# Altium project RockRTK.PrjPcb (part 1 of 2)
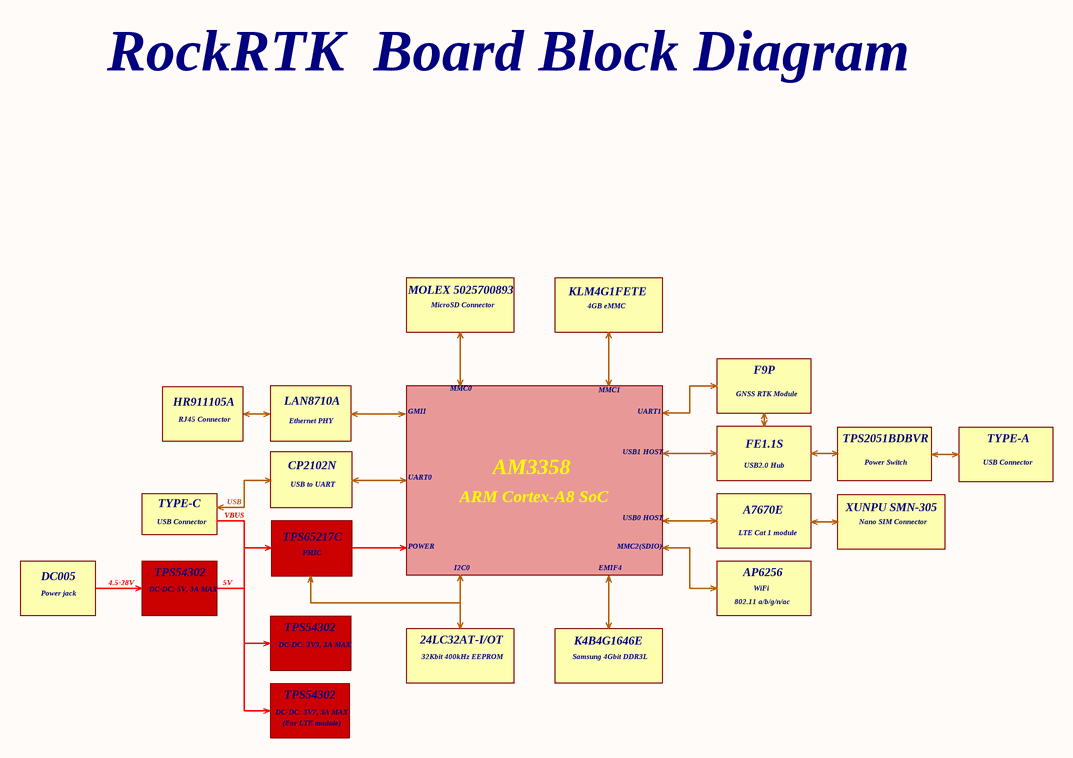
[diagram p0: BlockDiagram.SchDoc]
22 sheets, 400 parts. Net scope: hierarchical (ports join the sheet entries above them; power ports are global).
Board file: RockRTK.PcbDoc
Sheets:
  BlockDiagram.SchDoc
  Main.SchDoc
    DDR3L Chip = DDR3LChip.SchDoc
    AM3358 DDR Controller = SoC_DDR.SchDoc
    Designator = InputConnectors.SchDoc
    Designator = PMIC.SchDoc
    Designator = PowerSupplies.SchDoc
    Designator = SoC_BootMode.SchDoc
    Designator = SoC_Power.SchDoc
    Designator = SoC_Control.SchDoc
    Designator = eMMCChip.SchDoc
    SoC MMC = SoC_MMC.SchDoc
    Designator = SoC_Peripheral.SchDoc
    Designator = USBHub.SchDoc
    Designator = GNSSModule.SchDoc
    Designator = LTEModule.SchDoc
    Designator = WIFIModule.SchDoc
    Designator = EEPROM.SchDoc
    Designator = EthernetPHY.SchDoc
    Designator = SoC_MII.SchDoc
    Designator = SoC_Jtag.SchDoc
    Micro SD Card = SDCard.SchDoc

## Sheet BlockDiagram.SchDoc
size A4; SheetNumber: 1; SheetTotal: 22

### Notes on the sheet
- RockRTK  Board Block Diagram
- MOLEX 5025700893
- MicroSD Connector
- KLM4G1FETE
- 4GB eMMC
- MMC0
- MMC1
- GNSS RTK Module
- F9P
- HR911105A
- RJ45 Connector
- LAN8710A
- CP2102N
- Ethernet PHY
- GMII
- AM3358
- USB1 HOST
- UART1
- USB2.0 Hub
- FE1.1S
- TPS2051BDBVR
- Power Switch
- USB Connector
- TYPE-A
- TYPE-C
- VBUS
- USB
- USB to UART
- UART0
- ARM Cortex-A8 SoC
- USB0 HOST
- LTE Cat 1 module
- A7670E
- XUNPU SMN-305
- Nano SIM Connector
- DC005
- Power jack
- 4.5-28V
- DC-DC: 5V, 3A MAX
- TPS54302
- 5V
- TPS65217C
- PMIC
- POWER
- I2C0
- EMIF4
- MMC2(SDIO)
- 802.11 a/b/g/n/ac
- AP6256
- WiFi
- DC-DC: 3V3, 3A MAX
- 24LC32AT-I/OT
- 32Kbit 400kHz EEPROM
- Samsung 4Gbit DDR3L
- K4B4G1646E
- DC-DC: 3V7, 3A MAX
- (For LTE module)

## Sheet Main.SchDoc
size A3; SheetNumber: 2; SheetTotal: 22
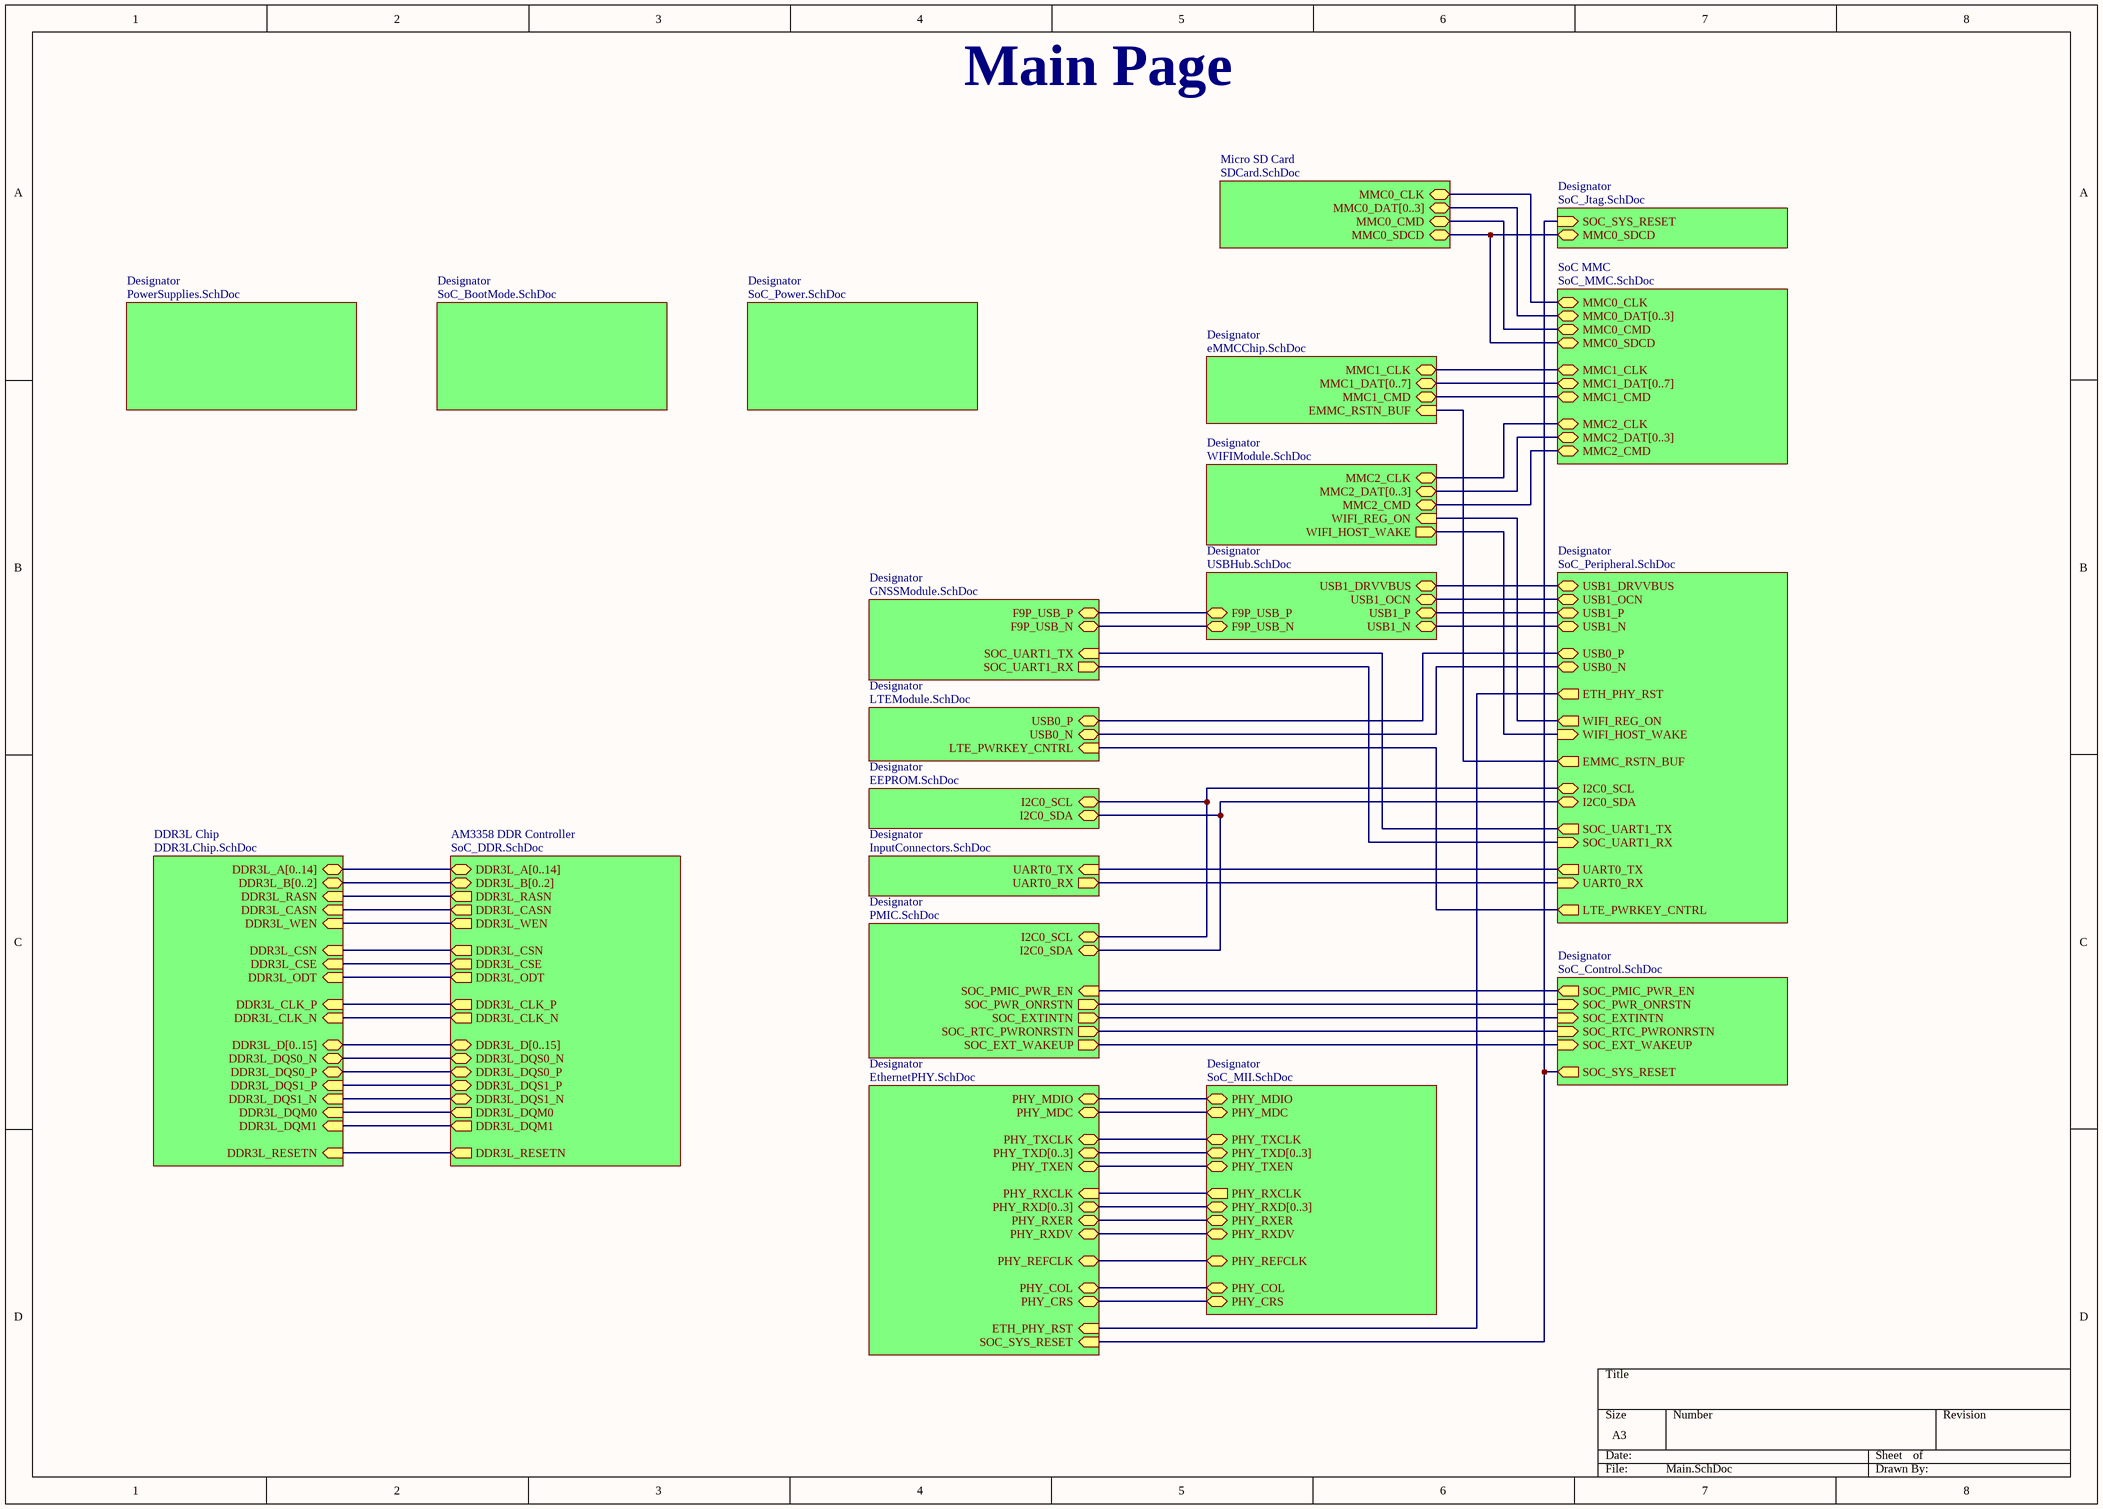
[diagram p1: Main.SchDoc]

### Sub-sheets
AM3358 DDR Controller = SoC_DDR.SchDoc: DDR3L_RASN (out), DDR3L_CASN (out), DDR3L_WEN (out), DDR3L_CSN (out), DDR3L_CSE (out), DDR3L_DQM0 (out), DDR3L_DQM1 (out), DDR3L_DQS0_N (bidir), DDR3L_DQS0_P (bidir), DDR3L_DQS1_N (bidir), DDR3L_RESETN (out), DDR3L_ODT (out), DDR3L_DQS1_P (bidir), DDR3L_A[0..14] (bidir), DDR3L_B[0..2] (bidir), DDR3L_D[0..15] (bidir), DDR3L_CLK_P (out), DDR3L_CLK_N (out)
DDR3L Chip = DDR3LChip.SchDoc: DDR3L_RASN (in), DDR3L_CASN (in), DDR3L_WEN (in), DDR3L_CSN (in), DDR3L_CSE (in), DDR3L_ODT (in), DDR3L_CLK_P (in), DDR3L_CLK_N (in), DDR3L_RESETN (in), DDR3L_DQM0 (in), DDR3L_DQM1 (in), DDR3L_DQS0_N (bidir), DDR3L_DQS0_P (bidir), DDR3L_DQS1_P (in), DDR3L_DQS1_N (in), DDR3L_A[0..14] (bidir), DDR3L_B[0..2] (bidir), DDR3L_D[0..15] (bidir)
Designator = InputConnectors.SchDoc: UART0_TX (in), UART0_RX (out)
Designator = PMIC.SchDoc: I2C0_SCL (bidir), I2C0_SDA (bidir), SOC_PMIC_PWR_EN (in), SOC_PWR_ONRSTN (out), SOC_EXTINTN (out), SOC_RTC_PWRONRSTN (out), SOC_EXT_WAKEUP (out)
Designator = PowerSupplies.SchDoc: no entries
Designator = SoC_BootMode.SchDoc: no entries
Designator = SoC_Power.SchDoc: no entries
Designator = SoC_Control.SchDoc: SOC_PMIC_PWR_EN (out), SOC_PWR_ONRSTN (in), SOC_RTC_PWRONRSTN (in), SOC_EXTINTN (in), SOC_EXT_WAKEUP (in), SOC_SYS_RESET (out)
Designator = eMMCChip.SchDoc: MMC1_CMD (bidir), MMC1_CLK (bidir), MMC1_DAT[0..7] (bidir), EMMC_RSTN_BUF (in)
Designator = SoC_Peripheral.SchDoc: USB1_OCN (bidir), USB1_DRVVBUS (bidir), I2C0_SCL (bidir), I2C0_SDA (bidir), SOC_UART1_TX (out), SOC_UART1_RX (in), UART0_TX (out), UART0_RX (in), USB0_P (bidir), USB0_N (bidir), WIFI_REG_ON (out), WIFI_HOST_WAKE (in), ETH_PHY_RST (out), USB1_P (bidir), USB1_N (bidir), EMMC_RSTN_BUF (out), LTE_PWRKEY_CNTRL (out)
Designator = USBHub.SchDoc: USB1_DRVVBUS (bidir), USB1_OCN (bidir), F9P_USB_P (bidir), F9P_USB_N (bidir), USB1_N (bidir), USB1_P (bidir)
Designator = GNSSModule.SchDoc: F9P_USB_P (bidir), F9P_USB_N (bidir), SOC_UART1_RX (out), SOC_UART1_TX (in)
Designator = LTEModule.SchDoc: LTE_PWRKEY_CNTRL (in), USB0_N (bidir), USB0_P (bidir)
Designator = WIFIModule.SchDoc: MMC2_CMD (bidir), MMC2_CLK (bidir), MMC2_DAT[0..3] (bidir), WIFI_HOST_WAKE (out), WIFI_REG_ON (in)
Designator = EEPROM.SchDoc: I2C0_SCL (bidir), I2C0_SDA (bidir)
Designator = EthernetPHY.SchDoc: SOC_SYS_RESET (in), ETH_PHY_RST (in), PHY_TXCLK (bidir), PHY_TXEN (bidir), PHY_RXDV (bidir), PHY_RXER (bidir), PHY_COL (bidir), PHY_CRS (bidir), PHY_RXD[0..3] (bidir), PHY_RXCLK (in), PHY_REFCLK (bidir), PHY_TXD[0..3] (bidir), PHY_MDIO (bidir), PHY_MDC (bidir)
Designator = SoC_MII.SchDoc: PHY_TXCLK (bidir), PHY_TXEN (bidir), PHY_REFCLK (bidir), PHY_RXD[0..3] (bidir), PHY_TXD[0..3] (bidir), PHY_RXDV (bidir), PHY_RXER (bidir), PHY_CRS (bidir), PHY_COL (bidir), PHY_RXCLK (out), PHY_MDIO (bidir), PHY_MDC (bidir)
Designator = SoC_Jtag.SchDoc: SOC_SYS_RESET (in), MMC0_SDCD (bidir)
Micro SD Card = SDCard.SchDoc: MMC0_DAT[0..3] (bidir), MMC0_CLK (bidir), MMC0_CMD (bidir), MMC0_SDCD (bidir)
SoC MMC = SoC_MMC.SchDoc: MMC0_CLK (bidir), MMC0_CMD (bidir), MMC0_SDCD (bidir), MMC0_DAT[0..3] (bidir), MMC1_DAT[0..7] (bidir), MMC1_CLK (bidir), MMC1_CMD (bidir), MMC2_DAT[0..3] (bidir), MMC2_CMD (bidir), MMC2_CLK (bidir)

### Nets
DDR3L_CASN: sheet DDR3L Chip/DDR3L_CASN, sheet AM3358 DDR Controller/DDR3L_CASN
DDR3L_CLK_N: sheet DDR3L Chip/DDR3L_CLK_N, sheet AM3358 DDR Controller/DDR3L_CLK_N
DDR3L_CLK_P: sheet DDR3L Chip/DDR3L_CLK_P, sheet AM3358 DDR Controller/DDR3L_CLK_P
DDR3L_CSE: sheet DDR3L Chip/DDR3L_CSE, sheet AM3358 DDR Controller/DDR3L_CSE
DDR3L_CSN: sheet DDR3L Chip/DDR3L_CSN, sheet AM3358 DDR Controller/DDR3L_CSN
DDR3L_DQM0: sheet DDR3L Chip/DDR3L_DQM0, sheet AM3358 DDR Controller/DDR3L_DQM0
DDR3L_DQM1: sheet DDR3L Chip/DDR3L_DQM1, sheet AM3358 DDR Controller/DDR3L_DQM1
DDR3L_DQS0_N: sheet DDR3L Chip/DDR3L_DQS0_N, sheet AM3358 DDR Controller/DDR3L_DQS0_N
DDR3L_DQS0_P: sheet DDR3L Chip/DDR3L_DQS0_P, sheet AM3358 DDR Controller/DDR3L_DQS0_P
DDR3L_DQS1_N: sheet DDR3L Chip/DDR3L_DQS1_N, sheet AM3358 DDR Controller/DDR3L_DQS1_N
DDR3L_DQS1_P: sheet DDR3L Chip/DDR3L_DQS1_P, sheet AM3358 DDR Controller/DDR3L_DQS1_P
DDR3L_ODT: sheet DDR3L Chip/DDR3L_ODT, sheet AM3358 DDR Controller/DDR3L_ODT
DDR3L_RASN: sheet DDR3L Chip/DDR3L_RASN, sheet AM3358 DDR Controller/DDR3L_RASN
DDR3L_RESETN: sheet DDR3L Chip/DDR3L_RESETN, sheet AM3358 DDR Controller/DDR3L_RESETN
DDR3L_WEN: sheet DDR3L Chip/DDR3L_WEN, sheet AM3358 DDR Controller/DDR3L_WEN
EMMC_RSTN_BUF: sheet Designator/EMMC_RSTN_BUF, sheet Designator/EMMC_RSTN_BUF
ETH_PHY_RST: sheet Designator/ETH_PHY_RST, sheet Designator/ETH_PHY_RST
F9P_USB_N: sheet Designator/F9P_USB_N, sheet Designator/F9P_USB_N
F9P_USB_P: sheet Designator/F9P_USB_P, sheet Designator/F9P_USB_P
I2C0_SCL: sheet Designator/I2C0_SCL, sheet Designator/I2C0_SCL, sheet Designator/I2C0_SCL
I2C0_SDA: sheet Designator/I2C0_SDA, sheet Designator/I2C0_SDA, sheet Designator/I2C0_SDA
LTE_PWRKEY_CNTRL: sheet Designator/LTE_PWRKEY_CNTRL, sheet Designator/LTE_PWRKEY_CNTRL
MMC0_CLK: sheet SoC MMC/MMC0_CLK, sheet Micro SD Card/MMC0_CLK
MMC0_CMD: sheet SoC MMC/MMC0_CMD, sheet Micro SD Card/MMC0_CMD
MMC0_SDCD: sheet SoC MMC/MMC0_SDCD, sheet Designator/MMC0_SDCD, sheet Micro SD Card/MMC0_SDCD
MMC1_CLK: sheet Designator/MMC1_CLK, sheet SoC MMC/MMC1_CLK
MMC1_CMD: sheet Designator/MMC1_CMD, sheet SoC MMC/MMC1_CMD
MMC2_CLK: sheet SoC MMC/MMC2_CLK, sheet Designator/MMC2_CLK
MMC2_CMD: sheet SoC MMC/MMC2_CMD, sheet Designator/MMC2_CMD
PHY_COL: sheet Designator/PHY_COL, sheet Designator/PHY_COL
PHY_CRS: sheet Designator/PHY_CRS, sheet Designator/PHY_CRS
PHY_MDC: sheet Designator/PHY_MDC, sheet Designator/PHY_MDC
PHY_MDIO: sheet Designator/PHY_MDIO, sheet Designator/PHY_MDIO
PHY_REFCLK: sheet Designator/PHY_REFCLK, sheet Designator/PHY_REFCLK
PHY_RXCLK: sheet Designator/PHY_RXCLK, sheet Designator/PHY_RXCLK
PHY_RXDV: sheet Designator/PHY_RXDV, sheet Designator/PHY_RXDV
PHY_RXER: sheet Designator/PHY_RXER, sheet Designator/PHY_RXER
PHY_TXCLK: sheet Designator/PHY_TXCLK, sheet Designator/PHY_TXCLK
PHY_TXEN: sheet Designator/PHY_TXEN, sheet Designator/PHY_TXEN
SOC_EXT_WAKEUP: sheet Designator/SOC_EXT_WAKEUP, sheet Designator/SOC_EXT_WAKEUP
SOC_EXTINTN: sheet Designator/SOC_EXTINTN, sheet Designator/SOC_EXTINTN
SOC_PMIC_PWR_EN: sheet Designator/SOC_PMIC_PWR_EN, sheet Designator/SOC_PMIC_PWR_EN
SOC_PWR_ONRSTN: sheet Designator/SOC_PWR_ONRSTN, sheet Designator/SOC_PWR_ONRSTN
SOC_RTC_PWRONRSTN: sheet Designator/SOC_RTC_PWRONRSTN, sheet Designator/SOC_RTC_PWRONRSTN
SOC_SYS_RESET: sheet Designator/SOC_SYS_RESET, sheet Designator/SOC_SYS_RESET, sheet Designator/SOC_SYS_RESET
SOC_UART1_RX: sheet Designator/SOC_UART1_RX, sheet Designator/SOC_UART1_RX
SOC_UART1_TX: sheet Designator/SOC_UART1_TX, sheet Designator/SOC_UART1_TX
UART0_RX: sheet Designator/UART0_RX, sheet Designator/UART0_RX
UART0_TX: sheet Designator/UART0_TX, sheet Designator/UART0_TX
USB0_N: sheet Designator/USB0_N, sheet Designator/USB0_N
USB0_P: sheet Designator/USB0_P, sheet Designator/USB0_P
USB1_DRVVBUS: sheet Designator/USB1_DRVVBUS, sheet Designator/USB1_DRVVBUS
USB1_N: sheet Designator/USB1_N, sheet Designator/USB1_N
USB1_OCN: sheet Designator/USB1_OCN, sheet Designator/USB1_OCN
USB1_P: sheet Designator/USB1_P, sheet Designator/USB1_P
WIFI_HOST_WAKE: sheet Designator/WIFI_HOST_WAKE, sheet Designator/WIFI_HOST_WAKE
WIFI_REG_ON: sheet Designator/WIFI_REG_ON, sheet Designator/WIFI_REG_ON

### Buses and harness runs
bus sheet AM3358 DDR Controller/DDR3L_A[0..14] = sheet DDR3L Chip/DDR3L_A[0..14]
bus sheet AM3358 DDR Controller/DDR3L_B[0..2] = sheet DDR3L Chip/DDR3L_B[0..2]
bus sheet AM3358 DDR Controller/DDR3L_D[0..15] = sheet DDR3L Chip/DDR3L_D[0..15]
bus sheet Designator/MMC1_DAT[0..7] = sheet SoC MMC/MMC1_DAT[0..7]
bus sheet Designator/MMC2_DAT[0..3] = sheet SoC MMC/MMC2_DAT[0..3]
bus sheet Micro SD Card/MMC0_DAT[0..3] = sheet SoC MMC/MMC0_DAT[0..3]

### Notes on the sheet
- Main Page

## Sheet DDR3LChip.SchDoc
size A3; SheetNumber: 6; SheetTotal: 22
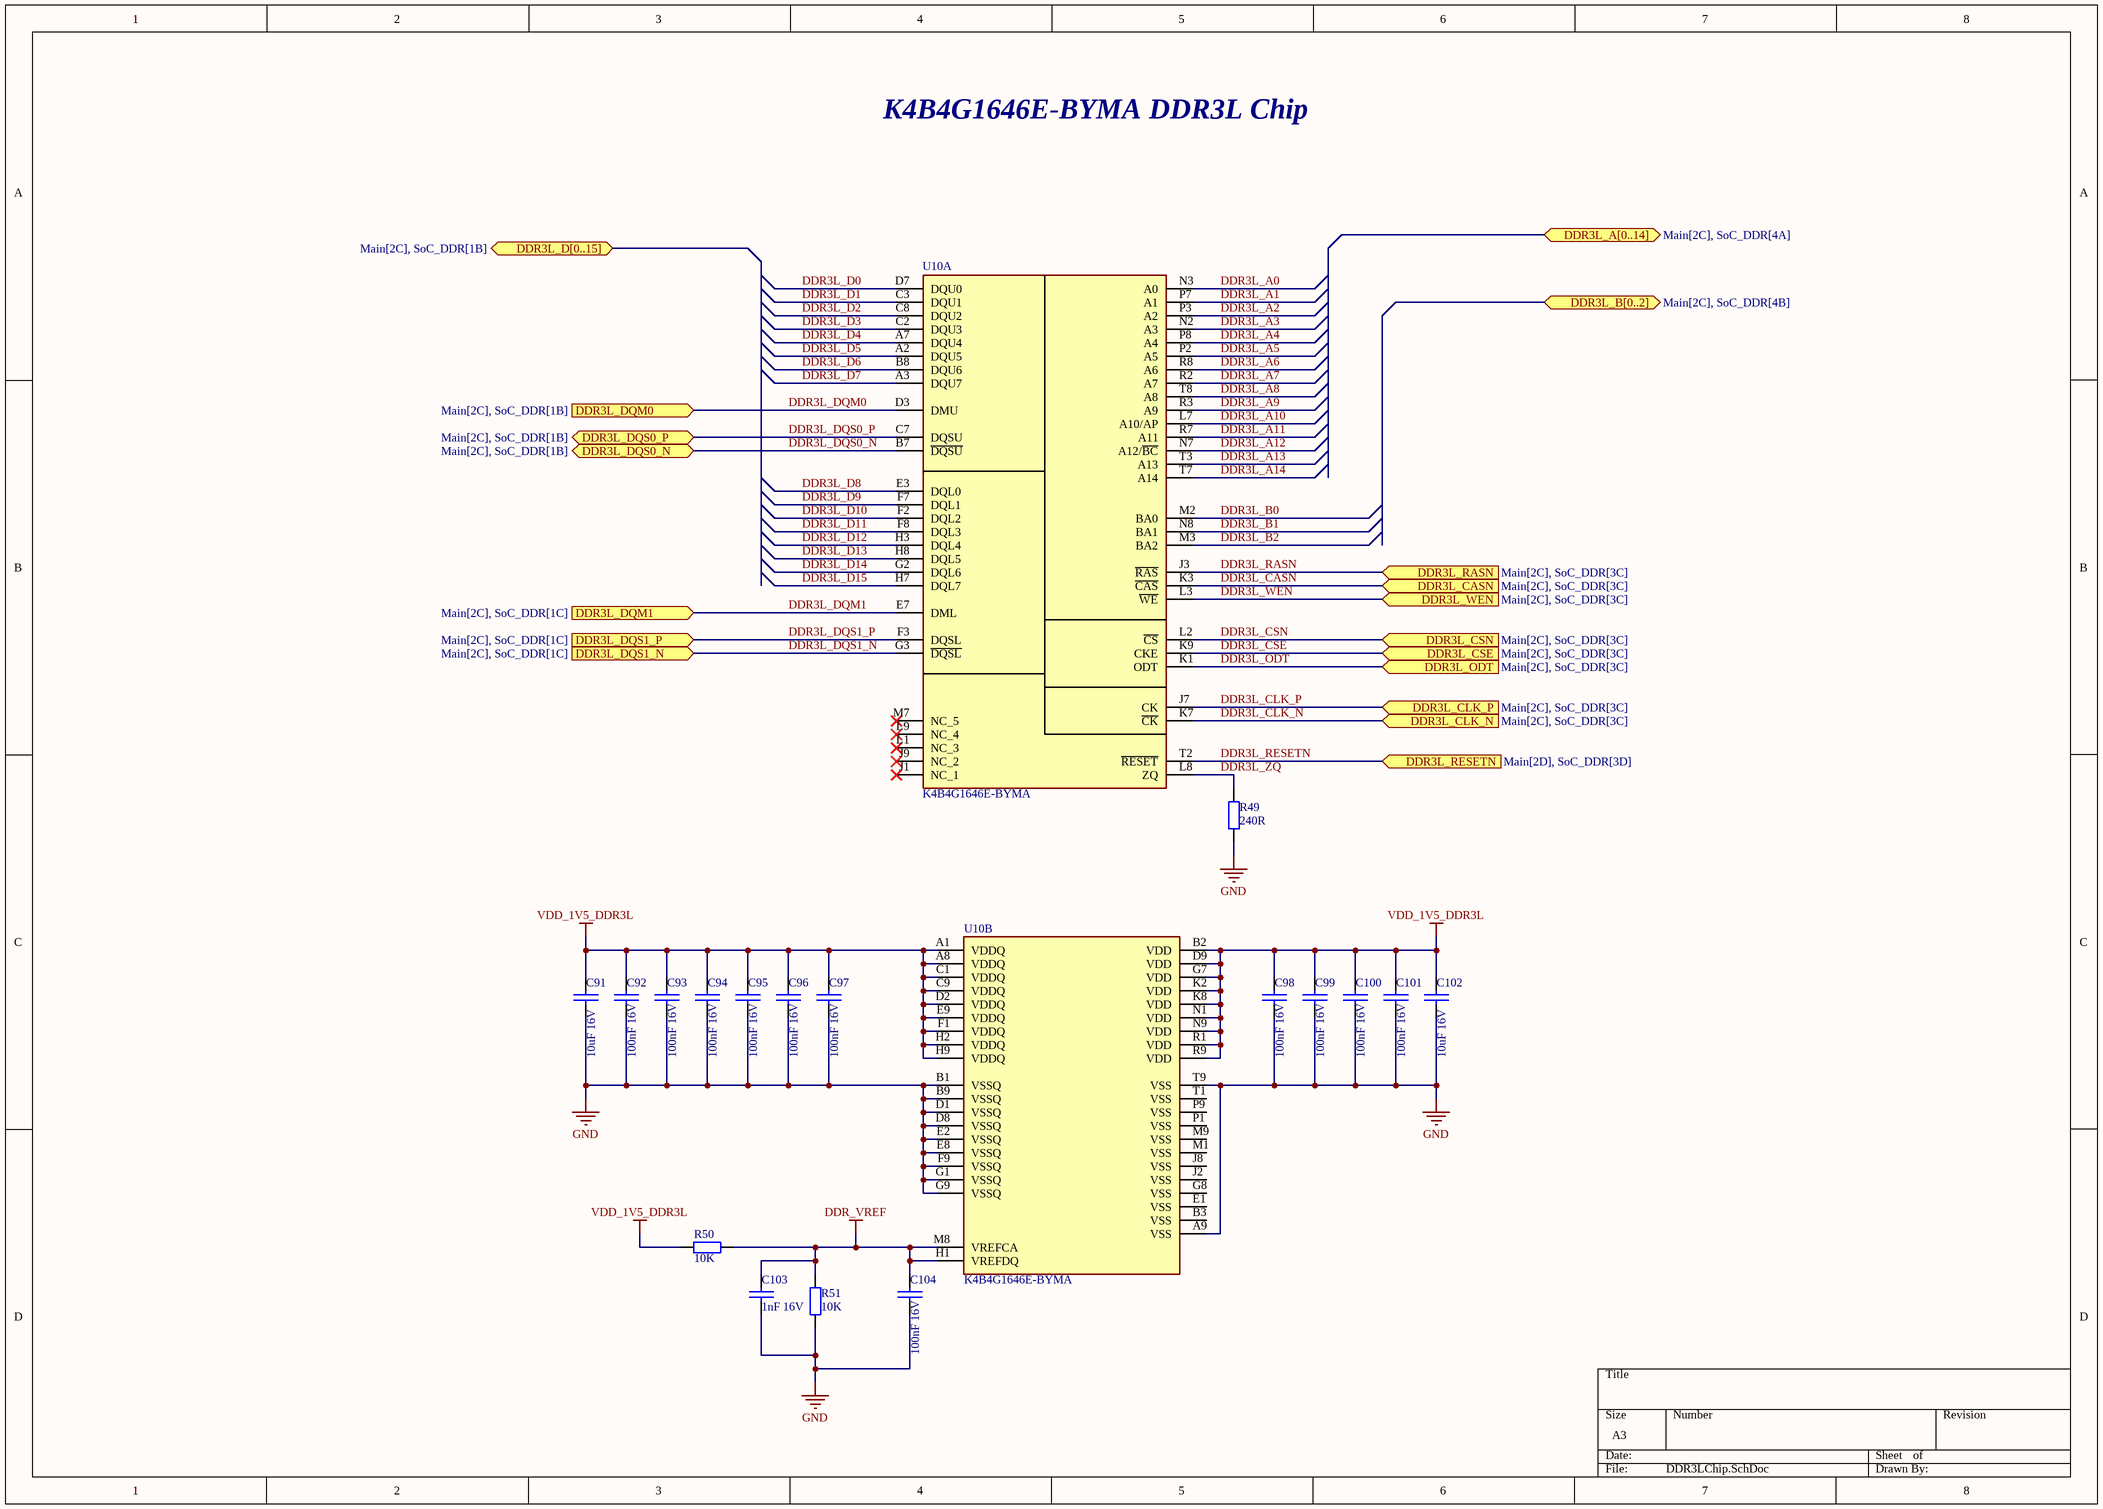
[diagram p2: DDR3LChip.SchDoc]

### Parts
C91  10uF 16V  [C_0603]
C92  100nF 16V  [C_0402]
C93  100nF 16V  [C_0402]
C94  100nF 16V  [C_0402]
C95  100nF 16V  [C_0402]
C96  100nF 16V  [C_0402]
C97  100nF 16V  [C_0402]
C98  100nF 16V  [C_0402]
C99  100nF 16V  [C_0402]
C100  100nF 16V  [C_0402]
C101  100nF 16V  [C_0402]
C102  10uF 16V  [C_0603]
C103  1nF 16V  [C_0402]
C104  100nF 16V  [C_0402]
R49  240R  [R_0402]
R50  10K  [R_0402]
R51  10K  [R_0402]
U10  K4B4G1646E-BYMA  [BGA96C80P9X16_750X1330X120]  (parts A,B of 2)

### Ports
DDR3L_A[0..14] (bidir, see Main[2C], SoC_DDR[4A]), DDR3L_B[0..2] (bidir, see Main[2C], SoC_DDR[4B]), DDR3L_CASN (in, see Main[2C], SoC_DDR[3C]), DDR3L_CLK_N (in, see Main[2C], SoC_DDR[3C]), DDR3L_CLK_P (in, see Main[2C], SoC_DDR[3C]), DDR3L_CSE (in, see Main[2C], SoC_DDR[3C]), DDR3L_CSN (in, see Main[2C], SoC_DDR[3C]), DDR3L_D[0..15] (bidir, see Main[2C], SoC_DDR[1B]), DDR3L_DQM0 (in, see Main[2C], SoC_DDR[1B]), DDR3L_DQM1 (in, see Main[2C], SoC_DDR[1C]), DDR3L_DQS0_N (bidir, see Main[2C], SoC_DDR[1B]), DDR3L_DQS0_P (bidir, see Main[2C], SoC_DDR[1B]), DDR3L_DQS1_N (in, see Main[2C], SoC_DDR[1C]), DDR3L_DQS1_P (in, see Main[2C], SoC_DDR[1C]), DDR3L_ODT (in, see Main[2C], SoC_DDR[3C]), DDR3L_RASN (in, see Main[2C], SoC_DDR[3C]), DDR3L_RESETN (in, see Main[2D], SoC_DDR[3D]), DDR3L_WEN (in, see Main[2C], SoC_DDR[3C])

### Nets
DDR_VREF: C103.1 C104.1 R50.1 R51.1 U10.H1(VREFDQ) U10.M8(VREFCA)
GND: C91.2 C92.2 C93.2 C94.2 C95.2 C96.2 C97.2 C98.2 C99.2 C100.2 C101.2 C102.2 C103.2 C104.2 R49.1 R51.2 U10.A9(VSS) U10.B1(VSSQ) U10.B9(VSSQ) U10.D1(VSSQ) U10.D8(VSSQ) U10.E2(VSSQ) U10.E8(VSSQ) U10.F9(VSSQ) U10.G1(VSSQ) U10.G9(VSSQ) U10.T9(VSS)
VDD_1V5_DDR3L: C91.1 C92.1 C93.1 C94.1 C95.1 C96.1 C97.1 C98.1 C99.1 C100.1 C101.1 C102.1 R50.2 U10.A1(VDDQ) U10.A8(VDDQ) U10.B2(VDD) U10.C1(VDDQ) U10.C9(VDDQ) U10.D2(VDDQ) U10.D9(VDD) U10.E9(VDDQ) U10.F1(VDDQ) U10.G7(VDD) U10.H2(VDDQ) U10.H9(VDDQ) U10.K2(VDD) U10.K8(VDD) U10.N1(VDD) U10.N9(VDD) U10.R1(VDD) U10.R9(VDD)
DDR3L_A0: U10.N3(A0)
DDR3L_A1: U10.P7(A1)
DDR3L_A2: U10.P3(A2)
DDR3L_A3: U10.N2(A3)
DDR3L_A4: U10.P8(A4)
DDR3L_A5: U10.P2(A5)
DDR3L_A6: U10.R8(A6)
DDR3L_A7: U10.R2(A7)
DDR3L_A8: U10.T8(A8)
DDR3L_A9: U10.R3(A9)
DDR3L_A10: U10.L7(A10/AP)
DDR3L_A11: U10.R7(A11)
DDR3L_A12: U10.N7(A12/~{BC})
DDR3L_A13: U10.T3(A13)
DDR3L_A14: U10.T7(A14)
DDR3L_B0: U10.M2(BA0)
DDR3L_B1: U10.N8(BA1)
DDR3L_B2: U10.M3(BA2)
DDR3L_CASN: U10.K3(~{CAS}) ; port DDR3L_CASN
DDR3L_CLK_N: U10.K7(~{CK}) ; port DDR3L_CLK_N
DDR3L_CLK_P: U10.J7(CK) ; port DDR3L_CLK_P
DDR3L_CSE: U10.K9(CKE) ; port DDR3L_CSE
DDR3L_CSN: U10.L2(~{CS}) ; port DDR3L_CSN
DDR3L_D0: U10.D7(DQU0)
DDR3L_D1: U10.C3(DQU1)
DDR3L_D2: U10.C8(DQU2)
DDR3L_D3: U10.C2(DQU3)
DDR3L_D4: U10.A7(DQU4)
DDR3L_D5: U10.A2(DQU5)
DDR3L_D6: U10.B8(DQU6)
DDR3L_D7: U10.A3(DQU7)
DDR3L_D8: U10.E3(DQL0)
DDR3L_D9: U10.F7(DQL1)
DDR3L_D10: U10.F2(DQL2)
DDR3L_D11: U10.F8(DQL3)
DDR3L_D12: U10.H3(DQL4)
DDR3L_D13: U10.H8(DQL5)
DDR3L_D14: U10.G2(DQL6)
DDR3L_D15: U10.H7(DQL7)
DDR3L_DQM0: U10.D3(DMU) ; port DDR3L_DQM0
DDR3L_DQM1: U10.E7(DML) ; port DDR3L_DQM1
DDR3L_DQS0_N: U10.B7(~{DQSU}) ; port DDR3L_DQS0_N
DDR3L_DQS0_P: U10.C7(DQSU) ; port DDR3L_DQS0_P
DDR3L_DQS1_N: U10.G3(~{DQSL}) ; port DDR3L_DQS1_N
DDR3L_DQS1_P: U10.F3(DQSL) ; port DDR3L_DQS1_P
DDR3L_ODT: U10.K1(ODT) ; port DDR3L_ODT
DDR3L_RASN: U10.J3(~{RAS}) ; port DDR3L_RASN
DDR3L_RESETN: U10.T2(~{RESET}) ; port DDR3L_RESETN
DDR3L_WEN: U10.L3(~{WE}) ; port DDR3L_WEN
DDR3L_ZQ: R49.2 U10.L8(ZQ)

Not connected (* = marked no-connect by the designer): U10 B3(VSS) E1(VSS) G8(VSS) J1(NC_1)* J2(VSS) J8(VSS) J9(NC_2)* L1(NC_3)* L9(NC_4)* M1(VSS) M7(NC_5)* M9(VSS) P1(VSS) P9(VSS) T1(VSS)

### Notes on the sheet
- K4B4G1646E-BYMA DDR3L Chip

### Library data of the parts
C91 C102 = C_0603: Capacitor 0603 SMD
C92-C101 C103 C104 = C_0402: Capacitor 0402 SMD
R49-R51 = R_0402: Resistor 0402 SMD
U10 = K4B4G1646E-BYMA: 4Gbit SDRAM DDR3L 933MHz FBGA-96(7.5x13.3) DDR SDRAM ROHS; Mnufacturer: Samsung; Manufacturer Part Number: K4B4G1646E-BYMA; Datasheet Link: https://download.semiconductor.samsung.com/resources/data-sheet/DS_K4B4G1646E_BY_M_Rev1_11-0.pdf

## Sheet SoC_DDR.SchDoc
size A4; SheetNumber: 18; SheetTotal: 22
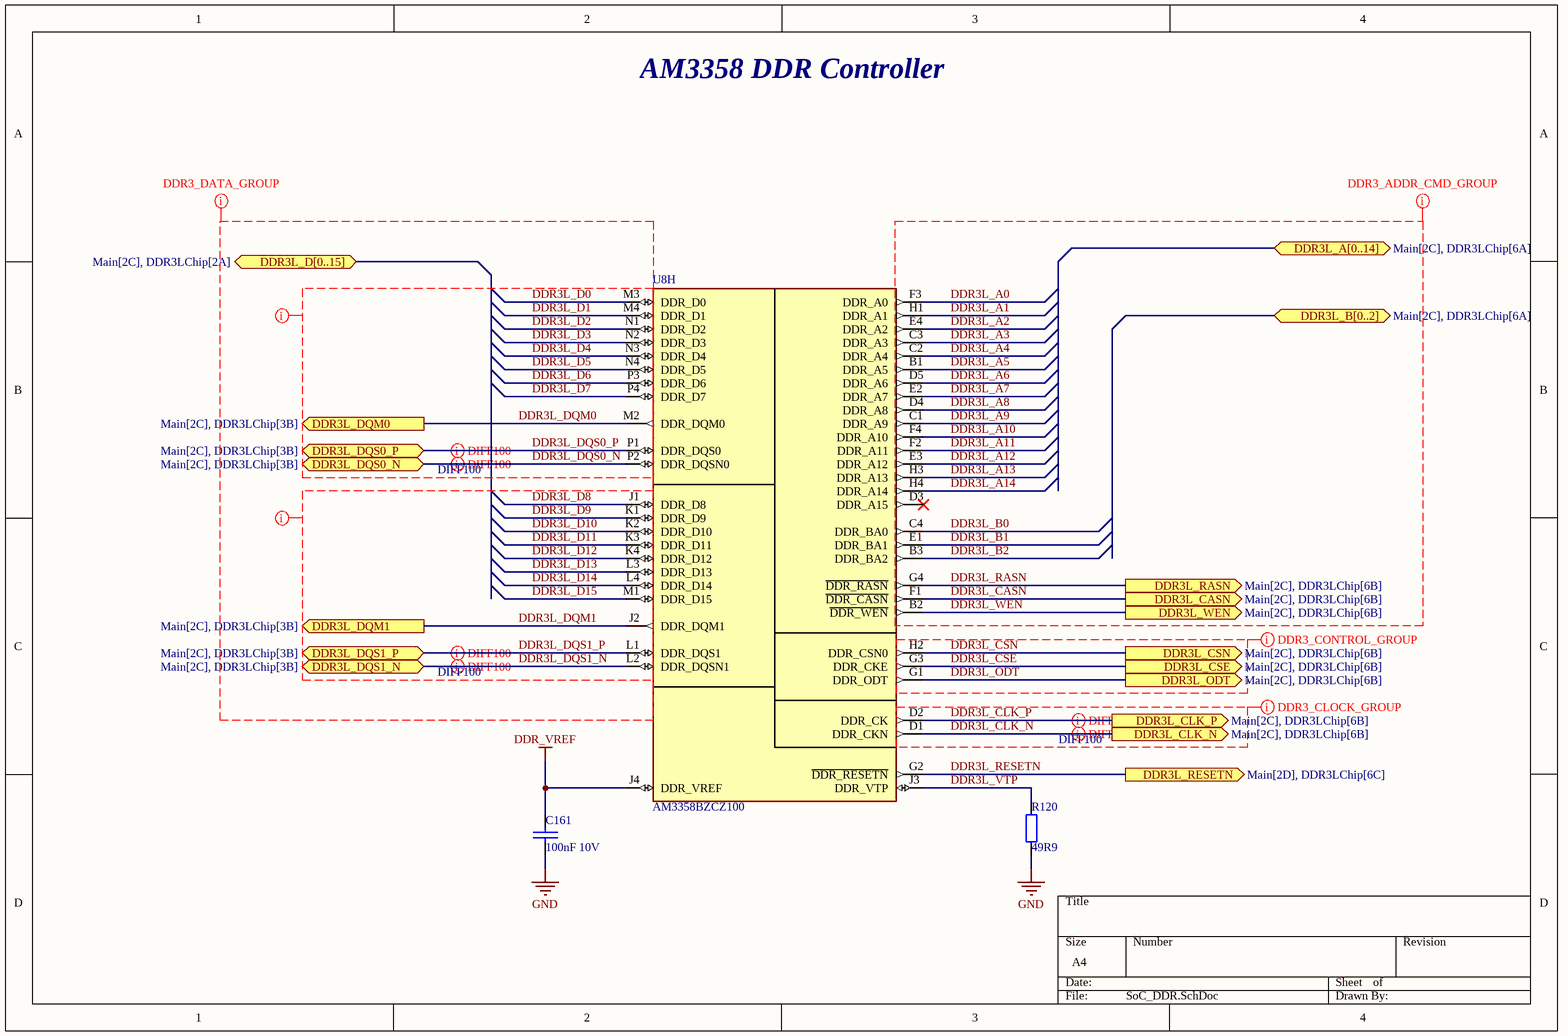
[diagram p3: SoC_DDR.SchDoc]

### Parts
C161  100nF 10V  [C_0201]
R120  49R9  [R_0402]
U8  AM3358BZCZ100  [BGA324C80P18X18_1500X1500X140]  (part H of 9)

### Ports
DDR3L_A[0..14] (bidir, see Main[2C], DDR3LChip[6A]), DDR3L_B[0..2] (bidir, see Main[2C], DDR3LChip[6A]), DDR3L_CASN (out, see Main[2C], DDR3LChip[6B]), DDR3L_CLK_N (out, see Main[2C], DDR3LChip[6B]), DDR3L_CLK_P (out, see Main[2C], DDR3LChip[6B]), DDR3L_CSE (out, see Main[2C], DDR3LChip[6B]), DDR3L_CSN (out, see Main[2C], DDR3LChip[6B]), DDR3L_D[0..15] (bidir, see Main[2C], DDR3LChip[2A]), DDR3L_DQM0 (out, see Main[2C], DDR3LChip[3B]), DDR3L_DQM1 (out, see Main[2C], DDR3LChip[3B]), DDR3L_DQS0_N (bidir, see Main[2C], DDR3LChip[3B]), DDR3L_DQS0_P (bidir, see Main[2C], DDR3LChip[3B]), DDR3L_DQS1_N (bidir, see Main[2C], DDR3LChip[3B]), DDR3L_DQS1_P (bidir, see Main[2C], DDR3LChip[3B]), DDR3L_ODT (out, see Main[2C], DDR3LChip[6B]), DDR3L_RASN (out, see Main[2C], DDR3LChip[6B]), DDR3L_RESETN (out, see Main[2D], DDR3LChip[6C]), DDR3L_WEN (out, see Main[2C], DDR3LChip[6B])

### Nets
DDR_VREF: C161.1 U8.J4(DDR_VREF)
GND: C161.2 R120.1
DDR3L_A0: U8.F3(DDR_A0)
DDR3L_A1: U8.H1(DDR_A1)
DDR3L_A2: U8.E4(DDR_A2)
DDR3L_A3: U8.C3(DDR_A3)
DDR3L_A4: U8.C2(DDR_A4)
DDR3L_A5: U8.B1(DDR_A5)
DDR3L_A6: U8.D5(DDR_A6)
DDR3L_A7: U8.E2(DDR_A7)
DDR3L_A8: U8.D4(DDR_A8)
DDR3L_A9: U8.C1(DDR_A9)
DDR3L_A10: U8.F4(DDR_A10)
DDR3L_A11: U8.F2(DDR_A11)
DDR3L_A12: U8.E3(DDR_A12)
DDR3L_A13: U8.H3(DDR_A13)
DDR3L_A14: U8.H4(DDR_A14)
DDR3L_B0: U8.C4(DDR_BA0)
DDR3L_B1: U8.E1(DDR_BA1)
DDR3L_B2: U8.B3(DDR_BA2)
DDR3L_CASN: U8.F1(~{DDR_CASN}) ; port DDR3L_CASN
DDR3L_CLK_N: U8.D1(DDR_CKN) ; port DDR3L_CLK_N
DDR3L_CLK_P: U8.D2(DDR_CK) ; port DDR3L_CLK_P
DDR3L_CSE: U8.G3(DDR_CKE) ; port DDR3L_CSE
DDR3L_CSN: U8.H2(DDR_CSN0) ; port DDR3L_CSN
DDR3L_D0: U8.M3(DDR_D0)
DDR3L_D1: U8.M4(DDR_D1)
DDR3L_D2: U8.N1(DDR_D2)
DDR3L_D3: U8.N2(DDR_D3)
DDR3L_D4: U8.N3(DDR_D4)
DDR3L_D5: U8.N4(DDR_D5)
DDR3L_D6: U8.P3(DDR_D6)
DDR3L_D7: U8.P4(DDR_D7)
DDR3L_D8: U8.J1(DDR_D8)
DDR3L_D9: U8.K1(DDR_D9)
DDR3L_D10: U8.K2(DDR_D10)
DDR3L_D11: U8.K3(DDR_D11)
DDR3L_D12: U8.K4(DDR_D12)
DDR3L_D13: U8.L3(DDR_D13)
DDR3L_D14: U8.L4(DDR_D14)
DDR3L_D15: U8.M1(DDR_D15)
DDR3L_DQM0: U8.M2(DDR_DQM0) ; port DDR3L_DQM0
DDR3L_DQM1: U8.J2(DDR_DQM1) ; port DDR3L_DQM1
DDR3L_DQS0_N: U8.P2(DDR_DQSN0) ; port DDR3L_DQS0_N
DDR3L_DQS0_P: U8.P1(DDR_DQS0) ; port DDR3L_DQS0_P
DDR3L_DQS1_N: U8.L2(DDR_DQSN1) ; port DDR3L_DQS1_N
DDR3L_DQS1_P: U8.L1(DDR_DQS1) ; port DDR3L_DQS1_P
DDR3L_ODT: U8.G1(DDR_ODT) ; port DDR3L_ODT
DDR3L_RASN: U8.G4(~{DDR_RASN}) ; port DDR3L_RASN
DDR3L_RESETN: U8.G2(~{DDR_RESETN}) ; port DDR3L_RESETN
DDR3L_VTP: R120.2 U8.J3(DDR_VTP)
DDR3L_WEN: U8.B2(~{DDR_WEN}) ; port DDR3L_WEN

Not connected (* = marked no-connect by the designer): U8 D3(DDR_A15)*

### Layout directives
differential pair; differential pair class DIFF100: DDR3L_CLK_N, DDR3L_CLK_P, DDR3L_DQS0_N, DDR3L_DQS0_P, DDR3L_DQS1_N, DDR3L_DQS1_P
net class DDR3_DATA_GROUP: DDR3L_D0, DDR3L_D1, DDR3L_D2, DDR3L_D3, DDR3L_D4, DDR3L_D5, DDR3L_D6, DDR3L_D7, DDR3L_D8, DDR3L_D9, DDR3L_D10, DDR3L_D11, DDR3L_D12, DDR3L_D13, DDR3L_D14, DDR3L_D15, DDR3L_DQM0, DDR3L_DQM1, DDR3L_DQS0_N, DDR3L_DQS0_P, DDR3L_DQS1_N, DDR3L_DQS1_P
net class DDR3_DATA_BYTE_GROUP_0: DDR3L_D0, DDR3L_D1, DDR3L_D2, DDR3L_D3, DDR3L_D4, DDR3L_D5, DDR3L_D6, DDR3L_D7, DDR3L_DQM0, DDR3L_DQS0_N, DDR3L_DQS0_P
net class DDR3_DATA_BYTE_GROUP_1: DDR3L_D8, DDR3L_D9, DDR3L_D10, DDR3L_D11, DDR3L_D12, DDR3L_D13, DDR3L_D14, DDR3L_D15, DDR3L_DQM1, DDR3L_DQS1_N, DDR3L_DQS1_P
net class DDR3_ADDR_CMD_GROUP: DDR3L_A0, DDR3L_A1, DDR3L_A2, DDR3L_A3, DDR3L_A4, DDR3L_A5, DDR3L_A6, DDR3L_A7, DDR3L_A8, DDR3L_A9, DDR3L_A10, DDR3L_A11, DDR3L_A12, DDR3L_A13, DDR3L_A14, DDR3L_B0, DDR3L_B1, DDR3L_B2, DDR3L_CASN, DDR3L_RASN, DDR3L_WEN
net class DDR3_CONTROL_GROUP: DDR3L_CSE, DDR3L_CSN, DDR3L_ODT
net class DDR3_CLOCK_GROUP: DDR3L_CLK_N, DDR3L_CLK_P

### Notes on the sheet
- AM3358 DDR Controller

### Library data of the parts
C161 = C_0201: Capacitor 0201 SMD
R120 = R_0402: Resistor 0402 SMD
U8 = AM3358BZCZ100: ARM-ASeries 1GHz NFBGA-324 Microcontrollers (MCU/MPU/SOC) ROHS; Manufacturer: Texas Instruments; Manufacturer Part Number: AM3358BZCZ100; Datasheet Link: https://www.ti.com/lit/ds/symlink/am3358.pdf

## Sheet InputConnectors.SchDoc
size A4; SheetNumber: 3; SheetTotal: 22
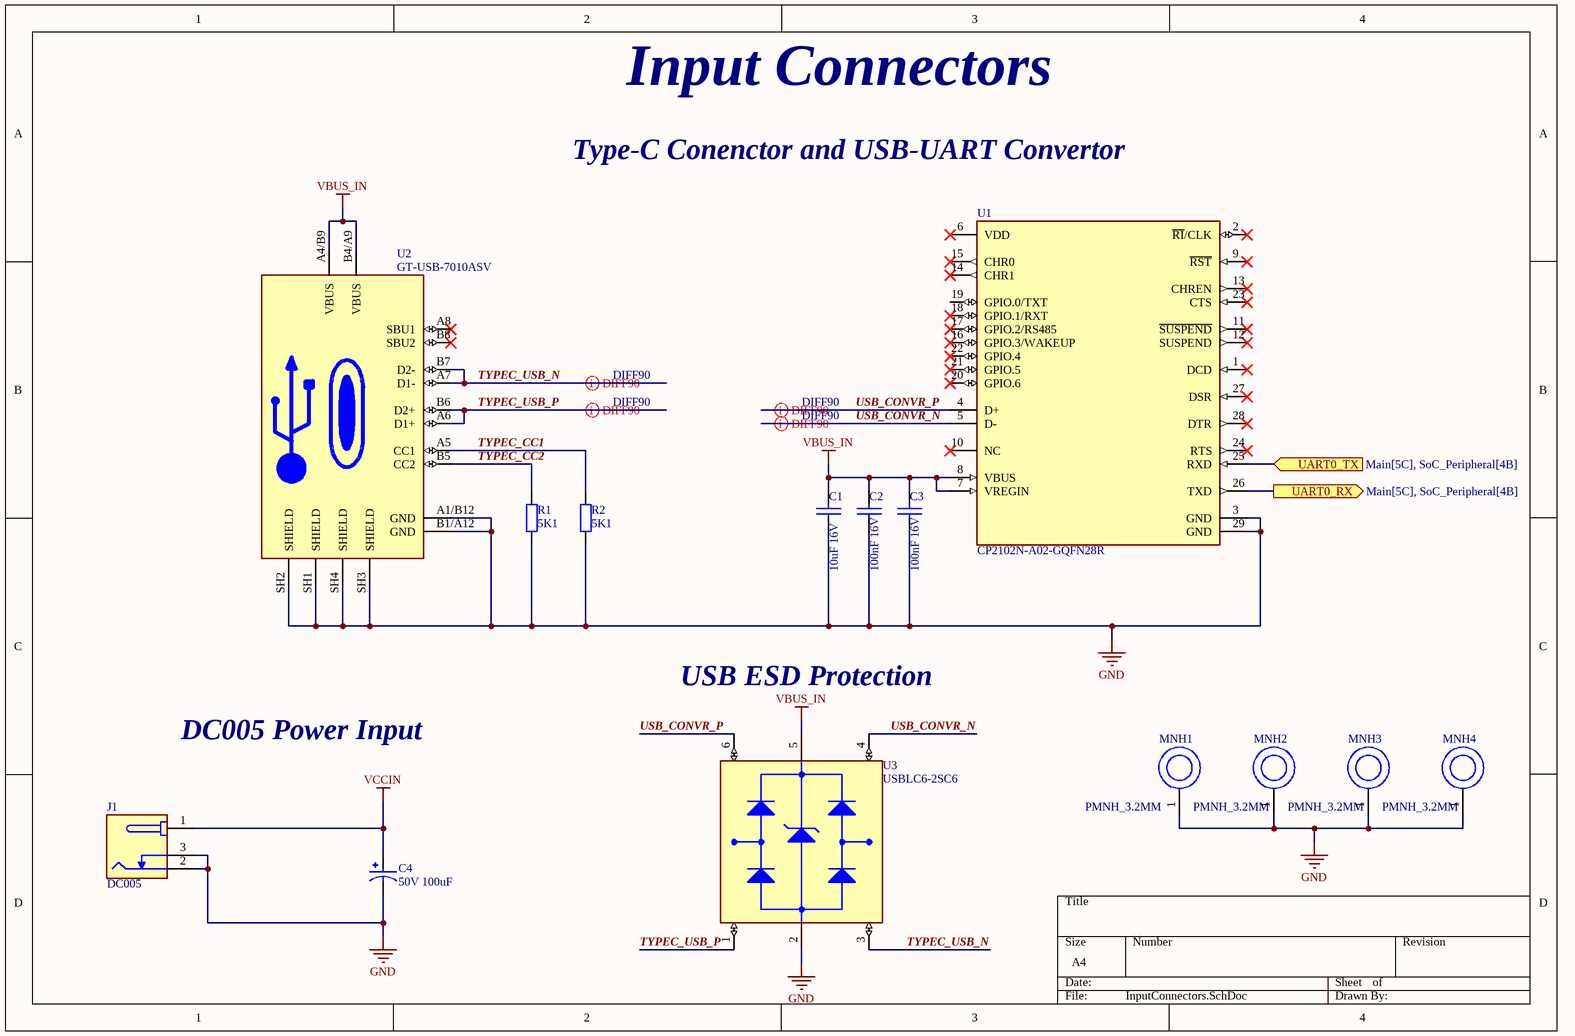
[diagram p4: InputConnectors.SchDoc]

### Parts
C1  10uF 16V  [C_0603]
C2  100nF 16V  [C_0402]
C3  100nF 16V  [C_0402]
C4  50V 100uF  [CAP_D6.3xL7.7mm]
J1  DC005  [DC005]
MNH1  PMNH_3.2MM  [PMNH_3.2MM]
MNH2  PMNH_3.2MM  [PMNH_3.2MM]
MNH3  PMNH_3.2MM  [PMNH_3.2MM]
MNH4  PMNH_3.2MM  [PMNH_3.2MM]
R1  5K1  [R_0603]
R2  5K1  [R_0603]
U1  CP2102N-A02-GQFN28R  [FP-CP2102N-A02-GQFN28R-MFG]
U2  GT-USB-7010ASV  [GT-USB-7010ASV]
U3  USBLC6-2SC6  [SOT-23-6]

### Ports
UART0_RX (out, see Main[5C], SoC_Peripheral[4B]), UART0_TX (in, see Main[5C], SoC_Peripheral[4B])

### Nets
GND: C1.2 C2.2 C3.2 C4.2 J1.2 J1.3 MNH1.1 MNH2.1 MNH3.1 MNH4.1 R1.1 R2.1 U1.3(GND) U1.29(GND) U2.A1/B12(GND) U2.B1/A12(GND) U2.SH1(SHIELD) U2.SH2(SHIELD) U2.SH3(SHIELD) U2.SH4(SHIELD) U3.2(GND)
VBUS_IN: C1.1 C2.1 C3.1 U1.7(VREGIN) U1.8(VBUS) U2.A4/B9(VBUS) U2.B4/A9(VBUS) U3.5(VBUS)
VCCIN: C4.1 J1.1
TYPEC_CC1: R2.2 U2.A5(CC1)
TYPEC_CC2: R1.2 U2.B5(CC2)
TYPEC_USB_N: U2.A7(D1-) U2.B7(D2-) U3.3(I/O2_IN)
TYPEC_USB_P: U2.A6(D1+) U2.B6(D2+) U3.1(I/O1_IN)
UART0_RX: U1.26(TXD) ; port UART0_RX
UART0_TX: U1.25(RXD) ; port UART0_TX
USB_CONVR_N: U1.5(D-) U3.4(I/O2_OUT)
USB_CONVR_P: U1.4(D+) U3.6(I/O1_OUT)

Not connected (* = marked no-connect by the designer): U1 1(DCD)* 2(~{RI}/CLK)* 6(VDD)* 9(~{RST})* 10(NC)* 11(~{SUSPEND})* 12(SUSPEND)* 13(CHREN)* 14(CHR1)* 15(CHR0)* 16(GPIO.3/WAKEUP)* 17(GPIO.2/RS485)* 18(GPIO.1/RXT)* 19(GPIO.0/TXT) 20(GPIO.6)* 21(GPIO.5)* 22(GPIO.4)* 23(CTS)* 24(RTS)* 27(DSR)* 28(DTR)*; U2 A8(SBU1)* B8(SBU2)*

### Layout directives
differential pair; differential pair class DIFF90: TYPEC_USB_N, TYPEC_USB_P, USB_CONVR_N, USB_CONVR_P

### Notes on the sheet
- Input Connectors
- Type-C Conenctor and USB-UART Convertor
- USB ESD Protection
- DC005 Power Input

### Library data of the parts
C1 = C_0603: Capacitor 0603 SMD
C2 C3 = C_0402: Capacitor 0402 SMD
C4 = RVT1H101M0607: 100uF 50V 229mA@120Hz ±20% SMD,D6.3xL7.7mm Aluminum Electrolytic Capacitors - SMD ROHS; Manudacturer: ROQANG; Manufacturer Part Number: RVT1H101M0607; Datasheet Link: https://www.lcsc.com/datasheet/lcsc_datasheet_2410121458_ROQANG-RVT1H101M0607_C3151829.pdf
J1 = DC005: Bend-in DC Power Receptacle -20℃~+70℃ 2mm 6.3mm 5A 24V Plugin DC Power Connectors ROHS
R1 R2 = R_0603: Resistor 0603 SMD
U1 = CMP-08093-000007-1: IC USB TO UART BRIDGE QFN28
U2 = GT-USB-7010ASV: USB 2.0 3A 1 Horizontal attachment 16P Female -40℃~+85℃ Type-C SMD USB Connectors ROHS; Manufacturer: G-Switch; Manufacturer Part Number: GT-USB-7010ASV; ComponentLink1Description: Datasheet Link; ComponentLink1URL: https://www.lcsc.com/datasheet/lcsc_datasheet_2411221125_G-Switch-GT-USB-7010ASV_C2988369.pdf
U3 = USBLC6-2SC6: 6A 12V 150W 6V Unidirectional 5V SOT-23-6 ESD and Surge Protection (TVS/ESD) ROHS; Manufacturer: STMicroelectronics; Manufacturer Part Number: USBLC6-2SC6; Datasheet Link: https://www.st.com/resource/en/datasheet/usblc6-2.pdf

## Sheet PMIC.SchDoc
size A4; SheetNumber: 4; SheetTotal: 22
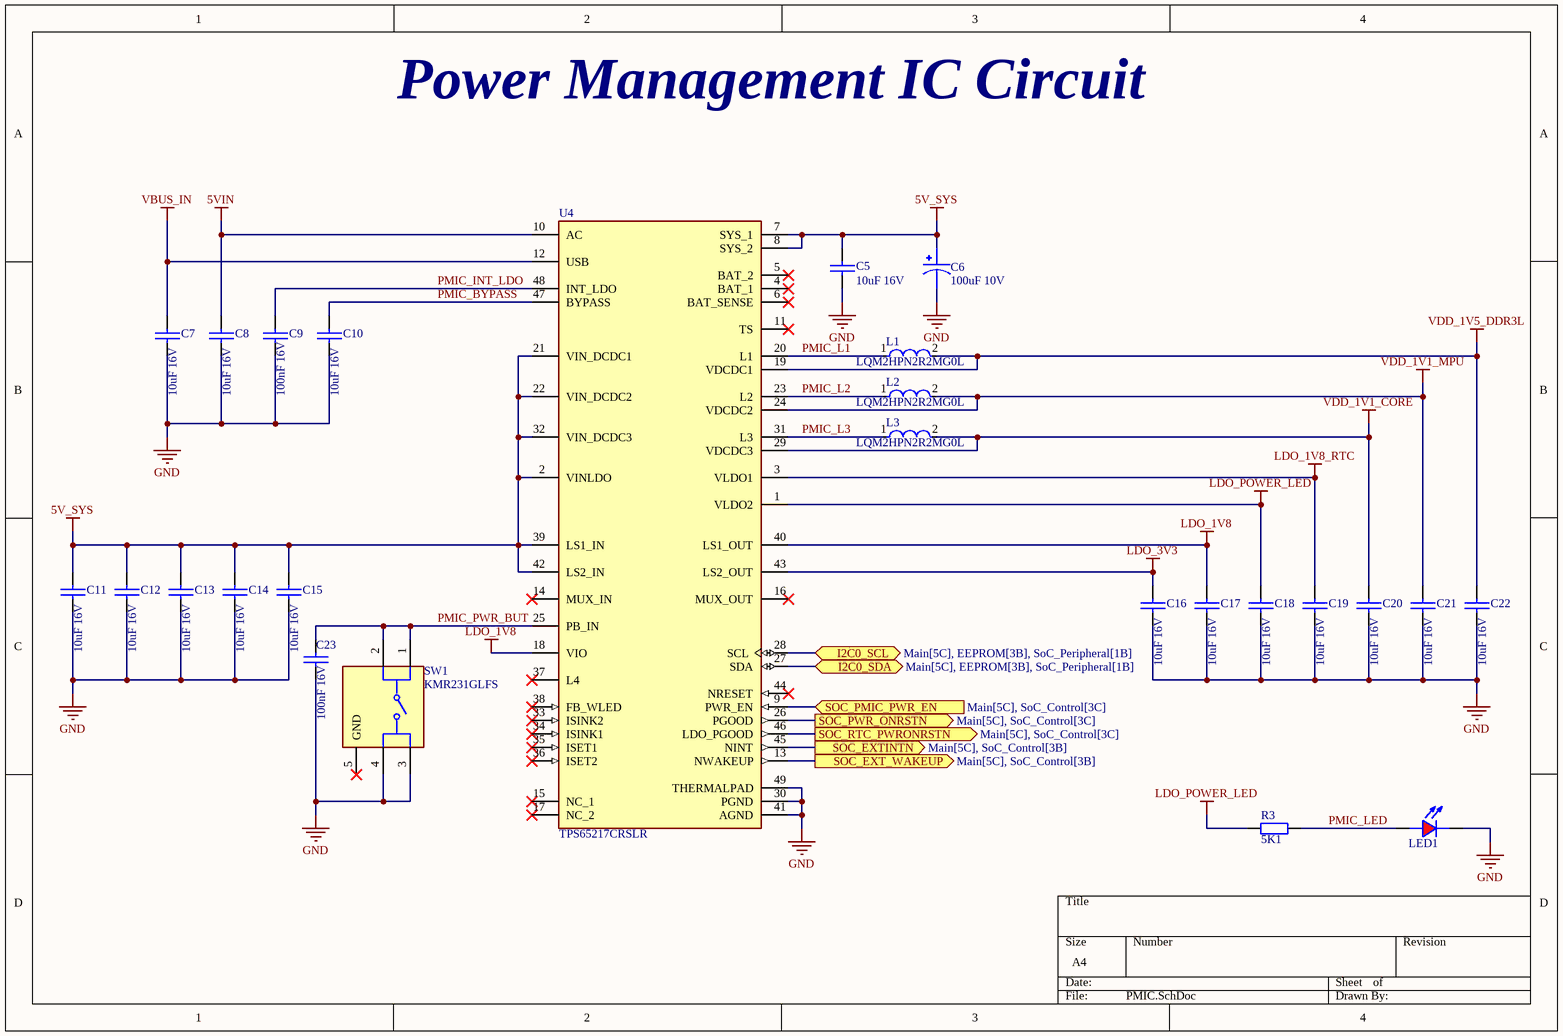
[diagram p5: PMIC.SchDoc]

### Parts
C5  10uF 16V  [C_0603]
C6  100uF 10V  [C_CASE-B]
C7  10uF 16V  [C_0603]
C8  10uF 16V  [C_0603]
C9  100nF 16V  [C_0402]
C10  10uF 16V  [C_0603]
C11  10uF 16V  [C_0603]
C12  10uF 16V  [C_0603]
C13  10uF 16V  [C_0603]
C14  10uF 16V  [C_0603]
C15  10uF 16V  [C_0603]
C16  10uF 16V  [C_0603]
C17  10uF 16V  [C_0603]
C18  10uF 16V  [C_0603]
C19  10uF 16V  [C_0603]
C20  10uF 16V  [C_0603]
C21  10uF 16V  [C_0603]
C22  10uF 16V  [C_0603]
C23  100nF 16V  [C_0402]
L1  LQM2HPN2R2MG0L  [FP-LQM2HPN_G0-IPC_C]
L2  LQM2HPN2R2MG0L  [FP-LQM2HPN_G0-IPC_C]
L3  LQM2HPN2R2MG0L  [FP-LQM2HPN_G0-IPC_C]
LED1  LED_0603_RED  [LED_0603]  (value not drawn)
R3  5K1  [R_0603]
SW1  KMR231GLFS  [FP-KMR231GLFS-MFG]
U4  TPS65217CRSLR  [QFN40P600X600X100-49N-D]

### Ports
I2C0_SCL (bidir, see Main[5C], EEPROM[3B], SoC_Peripheral[1B]), I2C0_SDA (bidir, see Main[5C], EEPROM[3B], SoC_Peripheral[1B]), SOC_EXT_WAKEUP (out, see Main[5C], SoC_Control[3B]), SOC_EXTINTN (out, see Main[5C], SoC_Control[3B]), SOC_PMIC_PWR_EN (in, see Main[5C], SoC_Control[3C]), SOC_PWR_ONRSTN (out, see Main[5C], SoC_Control[3C]), SOC_RTC_PWRONRSTN (out, see Main[5C], SoC_Control[3C])

### Nets
5V_SYS: C5.1 C6.1 C11.1 C12.1 C13.1 C14.1 C15.1 U4.2(VINLDO) U4.7(SYS_1) U4.8(SYS_2) U4.21(VIN_DCDC1) U4.22(VIN_DCDC2) U4.32(VIN_DCDC3) U4.39(LS1_IN) U4.42(LS2_IN)
5VIN: C8.1 U4.10(AC)
GND: C5.2 C6.2 C7.2 C8.2 C9.2 C10.2 C11.2 C12.2 C13.2 C14.2 C15.2 C16.2 C17.2 C18.2 C19.2 C20.2 C21.2 C22.2 C23.2 LED1.2(C) SW1.3 SW1.4 U4.30(PGND) U4.41(AGND) U4.49(THERMALPAD)
LDO_1V8: C17.1 U4.18(VIO) U4.40(LS1_OUT)
LDO_1V8_RTC: C19.1 U4.3(VLDO1)
LDO_3V3: C16.1 U4.43(LS2_OUT)
LDO_POWER_LED: C18.1 R3.2 U4.1(VLDO2)
VBUS_IN: C7.1 U4.12(USB)
VDD_1V1_CORE: C20.1 L3.2 U4.29(VDCDC3)
VDD_1V1_MPU: C21.1 L2.2 U4.24(VDCDC2)
VDD_1V5_DDR3L: C22.1 L1.2 U4.19(VDCDC1)
I2C0_SCL: U4.28(SCL) ; port I2C0_SCL
I2C0_SDA: U4.27(SDA) ; port I2C0_SDA
PMIC_BYPASS: C10.1 U4.47(BYPASS)
PMIC_INT_LDO: C9.1 U4.48(INT_LDO)
PMIC_L1: L1.1 U4.20(L1)
PMIC_L2: L2.1 U4.23(L2)
PMIC_L3: L3.1 U4.31(L3)
PMIC_LED: LED1.1(A) R3.1
PMIC_PWR_BUT: C23.1 SW1.1 SW1.2 U4.25(PB_IN)
SOC_EXT_WAKEUP: U4.13(NWAKEUP) ; port SOC_EXT_WAKEUP
SOC_EXTINTN: U4.45(NINT) ; port SOC_EXTINTN
SOC_PMIC_PWR_EN: U4.9(PWR_EN) ; port SOC_PMIC_PWR_EN
SOC_PWR_ONRSTN: U4.26(PGOOD) ; port SOC_PWR_ONRSTN
SOC_RTC_PWRONRSTN: U4.46(LDO_PGOOD) ; port SOC_RTC_PWRONRSTN

Not connected (* = marked no-connect by the designer): SW1 5(GND)*; U4 4(BAT_1)* 5(BAT_2)* 6(BAT_SENSE)* 11(TS)* 14(MUX_IN)* 15(NC_1)* 16(MUX_OUT)* 17(NC_2)* 33(ISINK2)* 34(ISINK1)* 35(ISET1)* 36(ISET2)* 37(L4)* 38(FB_WLED)* 44(NRESET)*

### Notes on the sheet
- Power Management IC Circuit

### Library data of the parts
C5 C7 C8 C10-C22 = C_0603: Capacitor 0603 SMD
C6 = C_CASE-B-3528-21: Tantalum capacitor CASE-B-3528-21
C9 C23 = C_0402: Capacitor 0402 SMD
L1-L3 = CMP-1662-00028-2: Multilayer Type Inductor for Power Lines, 1008 (2520), 2.2μH, 20%, 0.1Ω, 1.3A; Core Material: Ferrite; DC Resistance (DCR): 100mR; Inductance: 2.2uH; Test Frequency: 1MHz; Self Resonant Frequency: 40MHz; Shielding: Shielded; Depth: 2.2mm; Length: 2.5mm; Max DC Current: 1.3A; Military Standard: Not; Current Rating: 1.3A; Termination: SMD/SMT; Radiation Hardening: No; Tolerance: 20%; Height: 1.2mm; Case Code (Metric): 2520; DC Current: 1.3A; Inductance Tolerance: 20%; Packaging: Tape and Reel; Width: 2mm; REACH SVHC: No SVHC; Mount: Surface Mount; Max Operating Temperature: 125°C; Lead Free: Lead Free; Case/Package: 1008; Case Code (Imperial): 1008; Series: LQM2HP_G0; Height - Seated (Max): 0.039inch; Package Quantity: 3000; Min Operating Temperature: -55°C
R3 = R_0603: Resistor 0603 SMD
SW1 = CMP-2000-06516-3: SWITCH TACTILE SPST-NO 0.05A 32V; Switch Travel: 0.25mm; Current Rating: 50mA; Operating Force: 3N; Actuator Type: Standard; Illumination Type: Non-Illuminated; Mechanical Life: 150000Cycles; Insulation Resistance: 1GR; Contact Resistance: 100mR; Actuator Length: 0.5mm; Power Rating: 1W; Throw Configuration: SPST; Switch Function: Off-Mom; Min Operating Temperature: -40°C; Termination: Gull Wing; Orientation: Straight; Lead Free: Lead Free; Width: 2.8mm; Contact Material: Silver; Max Voltage Rating (DC): 32V; Max Current Rating: 50mA; Contact Plating: Silver; Radiation Hardening: No; Depth: 4.6mm; Mount: Surface Mount; Max Operating Temperature: 85°C; Case/Package: SMD/SMT; Contact Current Rating: 50mA; Length: 4.6mm; Package Quantity: 7000; Series: KMR2; REACH SVHC: No SVHC; Packaging: Cut Tape; Voltage Rating (DC): 32V
U4 = TPS65217CRSLR: TPS65217 Single-Chip PMIC for Battery-Powered Systems; Manufacturer: Texas Instruments; Manufacturer Part Number: TPS65217CRSLR; Datasheet Link: https://www.ti.com/lit/ds/symlink/tps65217.pdf

## Sheet PowerSupplies.SchDoc
size A4; SheetNumber: 5; SheetTotal: 22
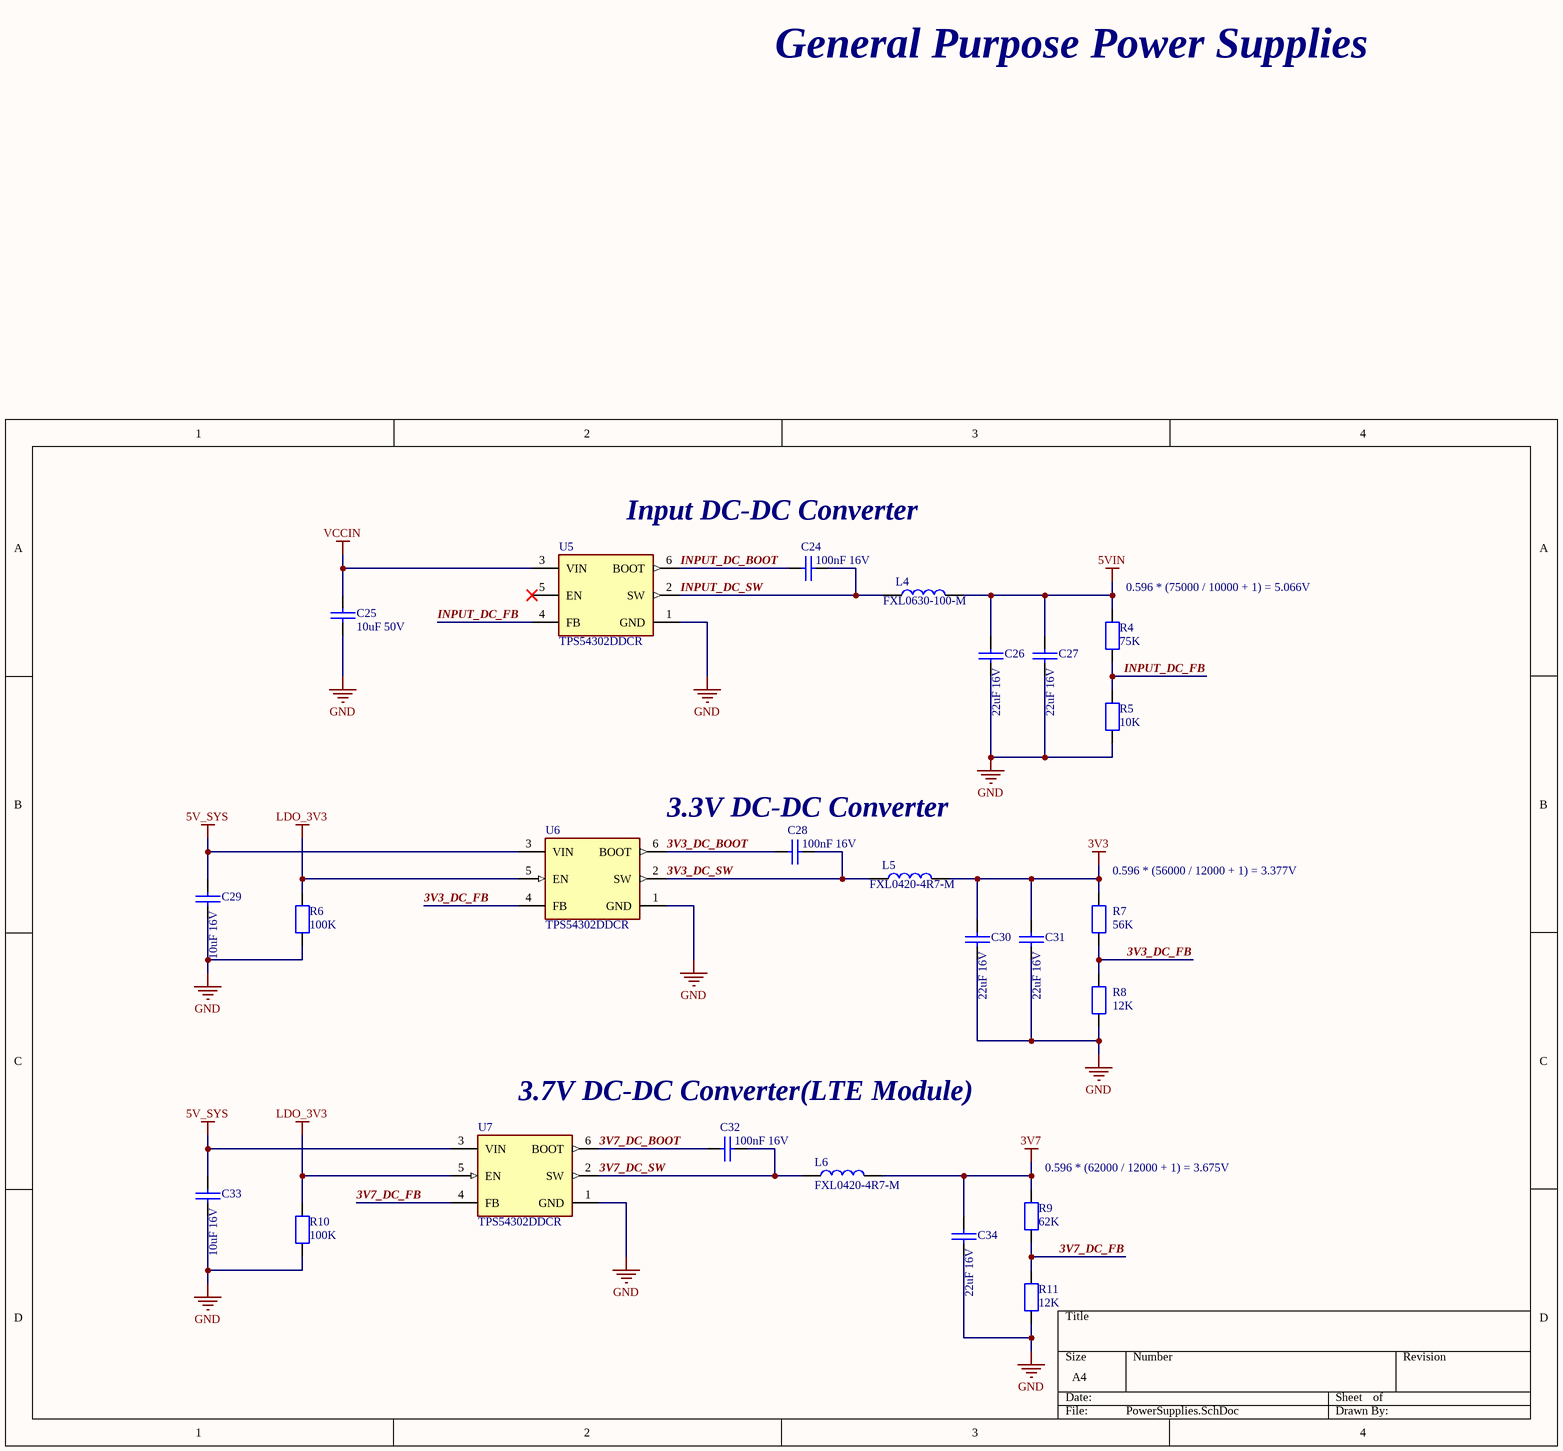
[diagram p6: PowerSupplies.SchDoc]

### Parts
C24  100nF 16V  [C_0402]
C25  10uF 50V  [C_1206]
C26  22uF 16V  [C_0603]
C27  22uF 16V  [C_0603]
C28  100nF 16V  [C_0402]
C29  10uF 16V  [C_0603]
C30  22uF 16V  [C_0603]
C31  22uF 16V  [C_0603]
C32  100nF 16V  [C_0402]
C33  10uF 16V  [C_0603]
C34  22uF 16V  [C_0603]
L4  FXL0630-100-M  [FXL0630]
L5  FXL0420-4R7-M  [FXL0420]
L6  FXL0420-4R7-M  [FXL0420]
R4  75K  [R_0603]
R5  10K  [R_0603]
R6  100K  [R_0603]
R7  56K  [R_0603]
R8  12K  [R_0603]
R9  62K  [R_0603]
R10  100K  [R_0603]
R11  12K  [R_0603]
U5  TPS54302DDCR  [FP-DDC0006A-MFG]
U6  TPS54302DDCR  [FP-DDC0006A-MFG]
U7  TPS54302DDCR  [FP-DDC0006A-MFG]

### Nets
3V3: C30.1 C31.1 L5.2 R7.2
3V7: C34.1 L6.2 R9.2
5V_SYS: C29.1 C33.1 U6.3(VIN) U7.3(VIN)
5VIN: C26.1 C27.1 L4.2 R4.2
GND: C25.2 C26.2 C27.2 C29.2 C30.2 C31.2 C33.2 C34.2 R5.1 R6.1 R8.1 R10.1 R11.1 U5.1(GND) U6.1(GND) U7.1(GND)
LDO_3V3: R6.2 R10.2 U6.5(EN) U7.5(EN)
VCCIN: C25.1 U5.3(VIN)
3V3_DC_BOOT: C28.1 U6.6(BOOT)
3V3_DC_FB: R7.1 R8.2 U6.4(FB)
3V3_DC_SW: C28.2 L5.1 U6.2(SW)
3V7_DC_BOOT: C32.1 U7.6(BOOT)
3V7_DC_FB: R9.1 R11.2 U7.4(FB)
3V7_DC_SW: C32.2 L6.1 U7.2(SW)
INPUT_DC_BOOT: C24.1 U5.6(BOOT)
INPUT_DC_FB: R4.1 R5.2 U5.4(FB)
INPUT_DC_SW: C24.2 L4.1 U5.2(SW)

Not connected (* = marked no-connect by the designer): U5 5(EN)*

### Notes on the sheet
- General Purpose Power Supplies
- Input DC-DC Converter
- (near R4) 0.596 * (75000 / 10000 + 1) = 5.066V
- 3.3V DC-DC Converter
- (near R7) 0.596 * (56000 / 12000 + 1) = 3.377V
- 3.7V DC-DC Converter(LTE Module)
- (near R9) 0.596 * (62000 / 12000 + 1) = 3.675V

### Library data of the parts
C24 C28 C32 = C_0402: Capacitor 0402 SMD
C25 = C_1206: Capacitor 1206 SMD
C26 C27 C29-C31 C33 C34 = C_0603: Capacitor 0603 SMD
L4 = FXL0630-100-M: 4.5A 10uH Winding Inductor ±20% 5.5A SMD,6.6x7mm Power Inductors ROHS; Manufacturer: cjiang; Manufacturer Part Number: FXL0630-150-M; Datasheet Link: https://www.lcsc.com/datasheet/lcsc_datasheet_2404260921_cjiang--Changjiang-Microelectronics-Tech-FXL0630-150-M_C177243.pdf
L5 L6 = FXL0420-4R7-M: 2.8A 4.7uH Winding Inductor ±20% 3A SMD,4.2x4.4mm Power Inductors ROHS; Manufacturer: cjiang (Changjiang Microelectronics Tech); Mfr. Part: FXL0420-100-M; Datasheet: https://www.lcsc.com/datasheet/lcsc_datasheet_2404260921_cjiang--Changjiang-Microelectronics-Tech-FXL0420-100-M_C177242.pdf
R4-R11 = R_0603: Resistor 0603 SMD
U5-U7 = CMP-04918-000032-1: IC REG BUCK ADJ 3A TSOT23-6; Manufacturer: Texas Instruments; Output Voltage: 0.6-26V; Output Type: AdjustableProgrammable; Max Junction Temp: +125°C; Number Of Outputs: 1; Min Supply Voltage: 4.5V; Switching Frequency: 400kHz; Standoff Height: 0mm; Max Duty Cycle: 100%; Nominal Supply Current: 45uA; Max Supply Voltage: 28V; Temperature Range High: +125°C; Switching Topology: Buck; Device Class L2: Power Management ICs; Output Current: 3A; Automotive: No; Temperature Range Low: -40°C; Temperature: -40°C to +125°C; Height: 1.1mm; Ipc Land Pattern Name: SOT95P280X110-6; RoHS: TRUE; Digikey Description: IC REG BUCK ADJ 3A TSOT23-6; Manufacturer Part Number: TPS54302DDCR; ComponentLink2Description: Datasheet; Device Class L3: Voltage Regulators - Switching; Octopart: https://octopart.com/tps54302ddcr-texas+instruments-74209025; Device Class L1: Integrated Circuits (ICs); Lead Free: Yes; ComponentLink2URL: http://www.ti.com/lit/ds/symlink/tps54302.pdf; Category: IC; Package: DDC0006A

## Sheet SoC_BootMode.SchDoc
size A4; SheetNumber: 17; SheetTotal: 22
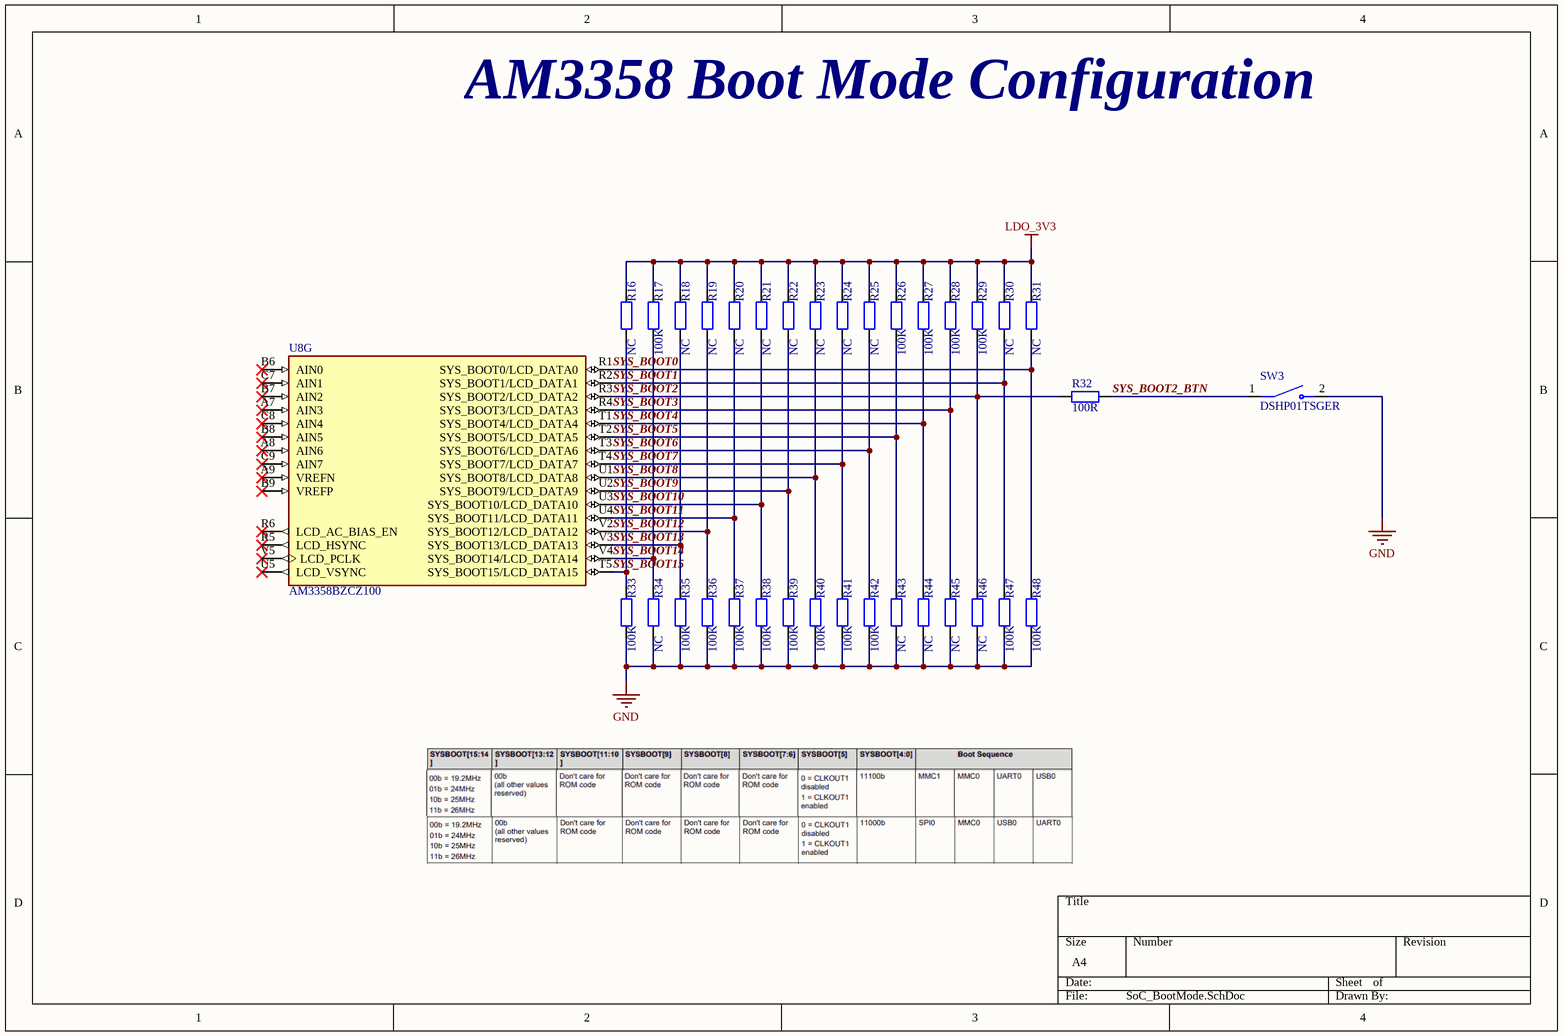
[diagram p7: SoC_BootMode.SchDoc]

### Parts
R16  NC  [R_0402]
R17  100K  [R_0402]
R18  NC  [R_0402]
R19  NC  [R_0402]
R20  NC  [R_0402]
R21  NC  [R_0402]
R22  NC  [R_0402]
R23  NC  [R_0402]
R24  NC  [R_0402]
R25  NC  [R_0402]
R26  100K  [R_0402]
R27  100K  [R_0402]
R28  100K  [R_0402]
R29  100K  [R_0402]
R30  NC  [R_0402]
R31  NC  [R_0402]
R32  100R  [R_0402]
R33  100K  [R_0402]
R34  NC  [R_0402]
R35  100K  [R_0402]
R36  100K  [R_0402]
R37  100K  [R_0402]
R38  100K  [R_0402]
R39  100K  [R_0402]
R40  100K  [R_0402]
R41  100K  [R_0402]
R42  100K  [R_0402]
R43  NC  [R_0402]
R44  NC  [R_0402]
R45  NC  [R_0402]
R46  NC  [R_0402]
R47  100K  [R_0402]
R48  100K  [R_0402]
SW3  DSHP01TSGER  [DSHP01TSGER]
U8  AM3358BZCZ100  [BGA324C80P18X18_1500X1500X140]  (part G of 9)

### Nets
GND: R33.1 R34.1 R35.1 R36.1 R37.1 R38.1 R39.1 R40.1 R41.1 R42.1 R43.1 R44.1 R45.1 R46.1 R47.1 R48.1 SW3.2(NO)
LDO_3V3: R16.2 R17.2 R18.2 R19.2 R20.2 R21.2 R22.2 R23.2 R24.2 R25.2 R26.2 R27.2 R28.2 R29.2 R30.2 R31.2
SYS_BOOT0: R31.1 R48.2 U8.R1(SYS_BOOT0/LCD_DATA0)
SYS_BOOT1: R30.1 R47.2 U8.R2(SYS_BOOT1/LCD_DATA1)
SYS_BOOT2: R29.1 R32.1 R46.2 U8.R3(SYS_BOOT2/LCD_DATA2)
SYS_BOOT2_BTN: R32.2 SW3.1(COM)
SYS_BOOT3: R28.1 R45.2 U8.R4(SYS_BOOT3/LCD_DATA3)
SYS_BOOT4: R27.1 R44.2 U8.T1(SYS_BOOT4/LCD_DATA4)
SYS_BOOT5: R26.1 R43.2 U8.T2(SYS_BOOT5/LCD_DATA5)
SYS_BOOT6: R25.1 R42.2 U8.T3(SYS_BOOT6/LCD_DATA6)
SYS_BOOT7: R24.1 R41.2 U8.T4(SYS_BOOT7/LCD_DATA7)
SYS_BOOT8: R23.1 R40.2 U8.U1(SYS_BOOT8/LCD_DATA8)
SYS_BOOT9: R22.1 R39.2 U8.U2(SYS_BOOT9/LCD_DATA9)
SYS_BOOT10: R21.1 R38.2 U8.U3(SYS_BOOT10/LCD_DATA10)
SYS_BOOT11: R20.1 R37.2 U8.U4(SYS_BOOT11/LCD_DATA11)
SYS_BOOT12: R19.1 R36.2 U8.V2(SYS_BOOT12/LCD_DATA12)
SYS_BOOT13: R18.1 R35.2 U8.V3(SYS_BOOT13/LCD_DATA13)
SYS_BOOT14: R17.1 R34.2 U8.V4(SYS_BOOT14/LCD_DATA14)
SYS_BOOT15: R16.1 R33.2 U8.T5(SYS_BOOT15/LCD_DATA15)

Not connected (* = marked no-connect by the designer): U8 A7(AIN3)* A8(AIN6)* A9(VREFN)* B6(AIN0)* B7(AIN2)* B8(AIN5)* B9(VREFP)* C7(AIN1)* C8(AIN4)* C9(AIN7)* R5(LCD_HSYNC)* R6(LCD_AC_BIAS_EN)* U5(LCD_VSYNC)* V5(LCD_PCLK)*

### Notes on the sheet
- AM3358 Boot Mode Configuration

### Library data of the parts
R16-R48 = R_0402: Resistor 0402 SMD
SW3 = DSHP01TSGER: 1 Digit SPST 24V Black 25mA 3000 Times SMD,2.9x5.4mm DIP Switches ROHS; Manufacturer: kangshen; Manufacturer Part Number: DSHP01TSGER; ComponentLink1Description: Datasheet Link; ComponentLink1URL: https://www.lcsc.com/datasheet/lcsc_datasheet_2411220122_kangshen-DSHP01TSGER_C3293141.pdf
U8 = AM3358BZCZ100: as U8 on sheet SoC_DDR; Manufacturer Part Number: AM3358BZCZ100; Datasheet Link: https://www.ti.com/lit/ds/symlink/am3358.pdf

## Sheet SoC_Power.SchDoc
size A3; SheetNumber: 15; SheetTotal: 22
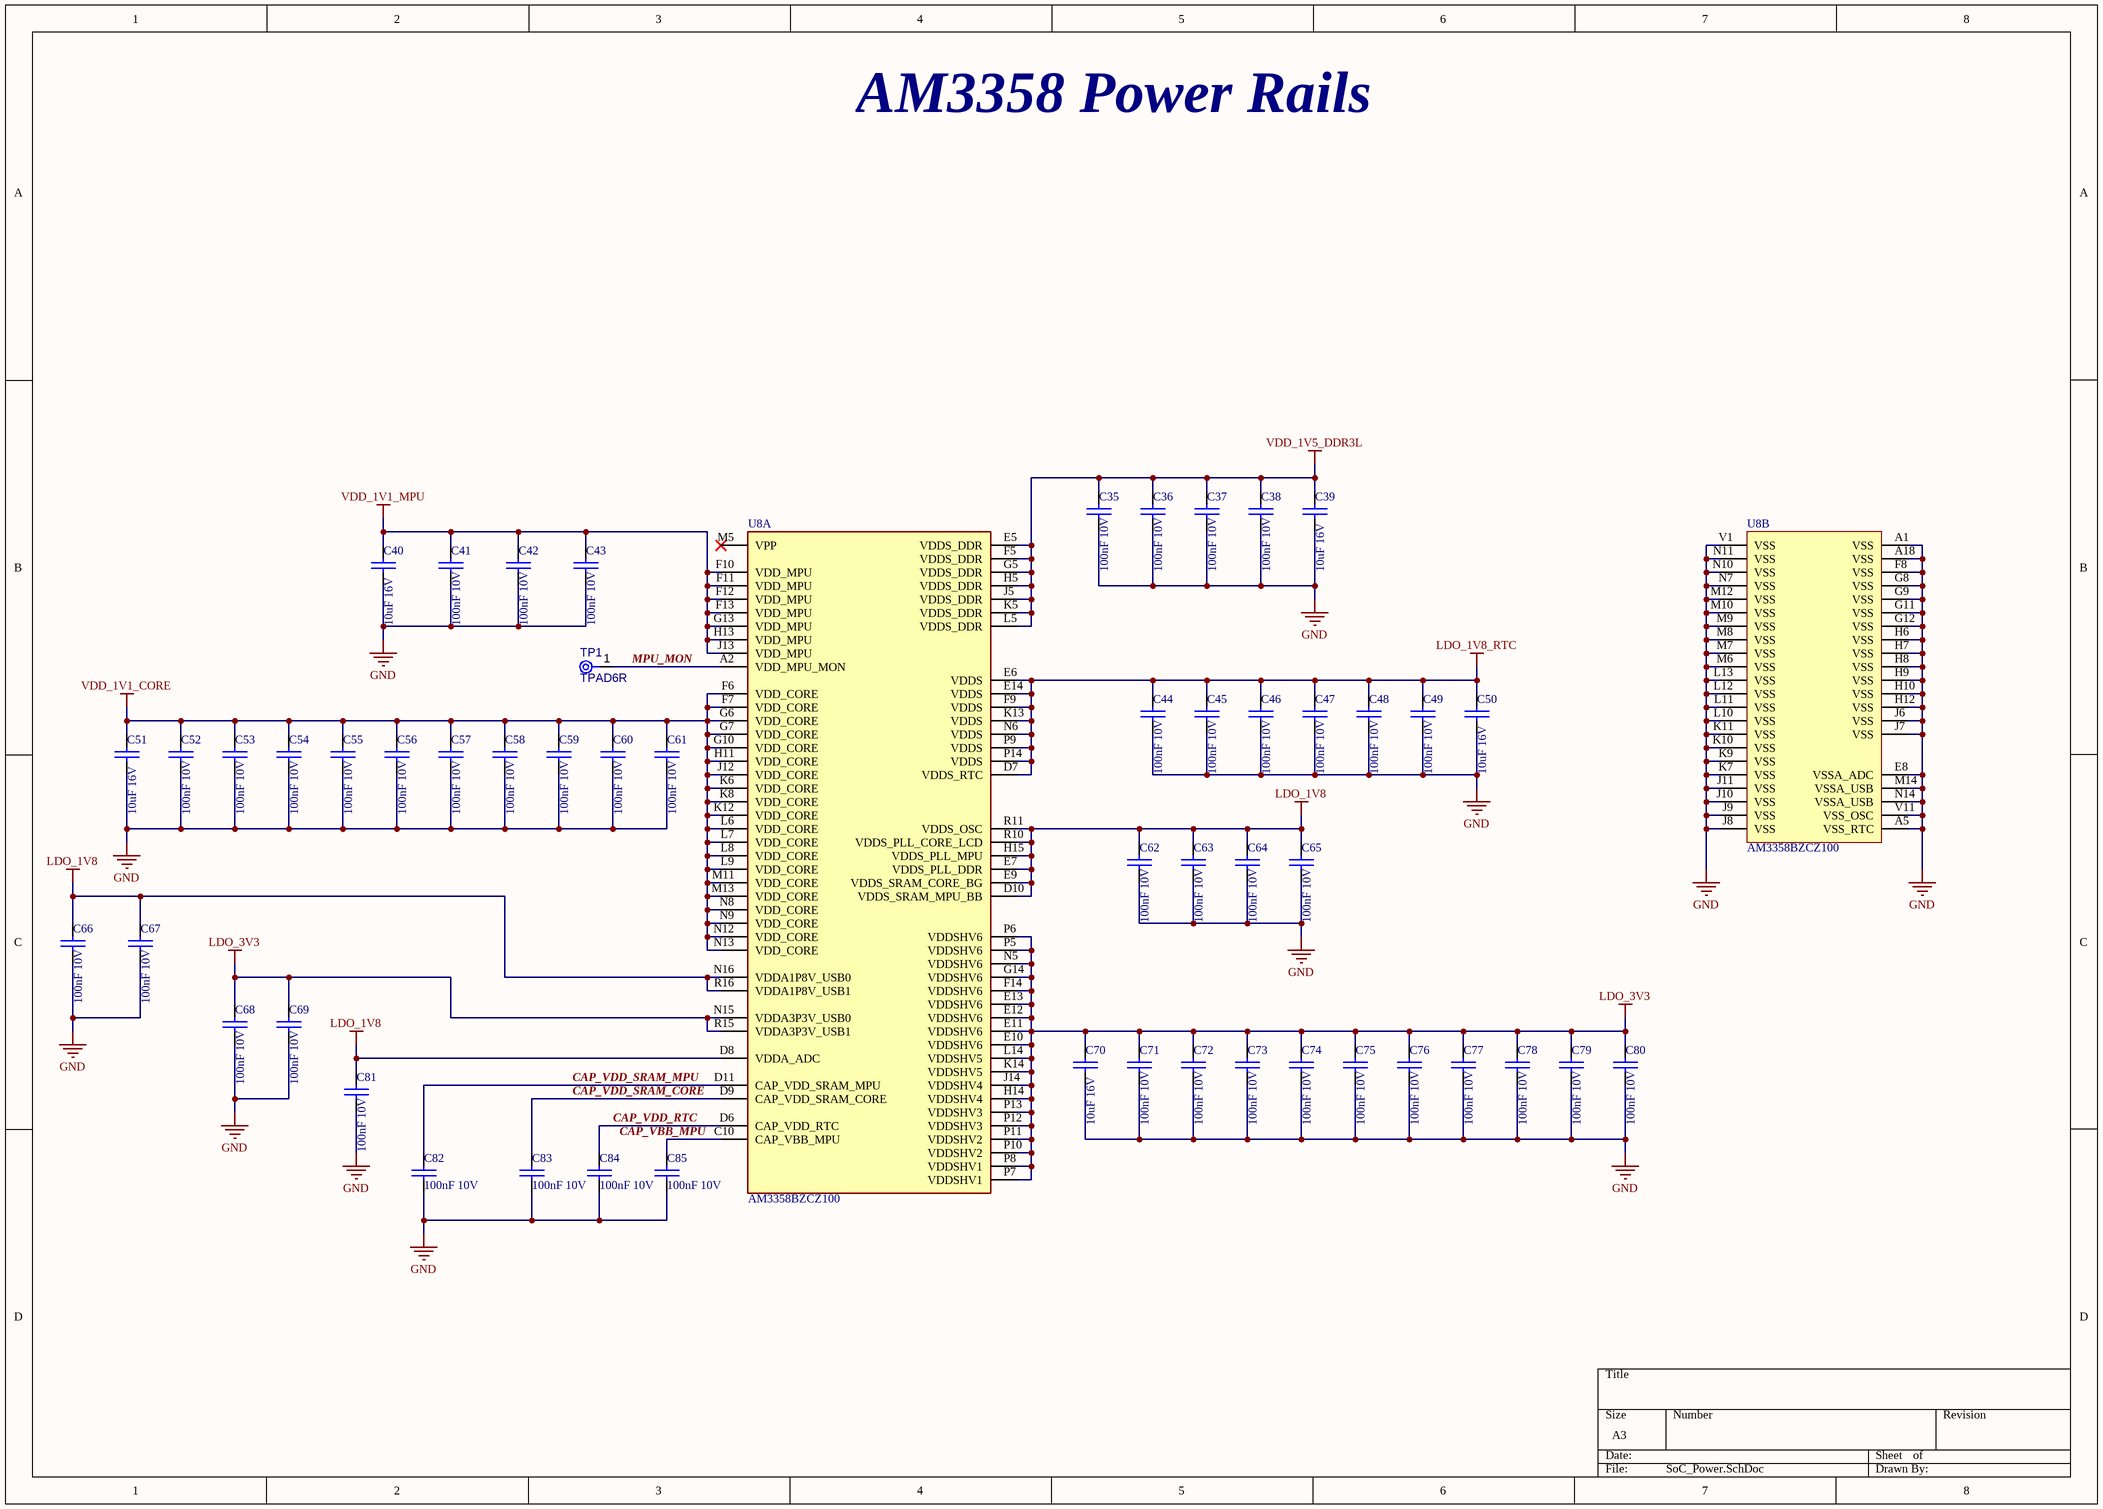
[diagram p8: SoC_Power.SchDoc]

### Parts
C35  100nF 10V  [C_0201]
C36  100nF 10V  [C_0201]
C37  100nF 10V  [C_0201]
C38  100nF 10V  [C_0201]
C39  10uF 16V  [C_0603]
C40  10uF 16V  [C_0603]
C41  100nF 10V  [C_0201]
C42  100nF 10V  [C_0201]
C43  100nF 10V  [C_0201]
C44  100nF 10V  [C_0201]
C45  100nF 10V  [C_0201]
C46  100nF 10V  [C_0201]
C47  100nF 10V  [C_0201]
C48  100nF 10V  [C_0201]
C49  100nF 10V  [C_0201]
C50  10uF 16V  [C_0603]
C51  10uF 16V  [C_0603]
C52  100nF 10V  [C_0201]
C53  100nF 10V  [C_0201]
C54  100nF 10V  [C_0201]
C55  100nF 10V  [C_0201]
C56  100nF 10V  [C_0201]
C57  100nF 10V  [C_0201]
C58  100nF 10V  [C_0201]
C59  100nF 10V  [C_0201]
C60  100nF 10V  [C_0201]
C61  100nF 10V  [C_0201]
C62  100nF 10V  [C_0201]
C63  100nF 10V  [C_0201]
C64  100nF 10V  [C_0201]
C65  100nF 10V  [C_0201]
C66  100nF 10V  [C_0201]
C67  100nF 10V  [C_0201]
C68  100nF 10V  [C_0201]
C69  100nF 10V  [C_0201]
C70  10uF 16V  [C_0603]
C71  100nF 10V  [C_0201]
C72  100nF 10V  [C_0201]
C73  100nF 10V  [C_0201]
C74  100nF 10V  [C_0201]
C75  100nF 10V  [C_0201]
C76  100nF 10V  [C_0201]
C77  100nF 10V  [C_0201]
C78  100nF 10V  [C_0201]
C79  100nF 10V  [C_0201]
C80  100nF 10V  [C_0201]
C81  100nF 10V  [C_0201]
C82  100nF 10V  [C_0201]
C83  100nF 10V  [C_0201]
C84  100nF 10V  [C_0201]
C85  100nF 10V  [C_0201]
TP1  TPAD6R  [TP06R]  (no BOM)
U8  AM3358BZCZ100  [BGA324C80P18X18_1500X1500X140]  (parts A,B of 9)

### Nets
GND: C35.2 C36.2 C37.2 C38.2 C39.2 C40.2 C41.2 C42.2 C43.2 C44.2 C45.2 C46.2 C47.2 C48.2 C49.2 C50.2 C51.2 C52.2 C53.2 C54.2 C55.2 C56.2 C57.2 C58.2 C59.2 C60.2 C61.2 C62.2 C63.2 C64.2 C65.2 C66.2 C67.2 C68.2 C69.2 C70.2 C71.2 C72.2 C73.2 C74.2 C75.2 C76.2 C77.2 C78.2 C79.2 C80.2 C81.2 C82.2 C83.2 C84.2 C85.2 U8.A1(VSS) U8.A5(VSS_RTC) U8.A18(VSS) U8.E8(VSSA_ADC) U8.F8(VSS) U8.G8(VSS) U8.G9(VSS) U8.G11(VSS) U8.G12(VSS) U8.H6(VSS) U8.H7(VSS) U8.H8(VSS) U8.H9(VSS) U8.H10(VSS) U8.H12(VSS) U8.J6(VSS) U8.J7(VSS) U8.J8(VSS) U8.J9(VSS) U8.J10(VSS) U8.J11(VSS) U8.K7(VSS) U8.K9(VSS) U8.K10(VSS) U8.K11(VSS) U8.L10(VSS) U8.L11(VSS) U8.L12(VSS) U8.L13(VSS) U8.M6(VSS) U8.M7(VSS) U8.M8(VSS) U8.M9(VSS) U8.M10(VSS) U8.M12(VSS) U8.M14(VSSA_USB) U8.N7(VSS) U8.N10(VSS) U8.N11(VSS) U8.N14(VSSA_USB) U8.V1(VSS) U8.V11(VSS_OSC)
LDO_1V8: C62.1 C63.1 C64.1 C65.1 C66.1 C67.1 C81.1 U8.D8(VDDA_ADC) U8.D10(VDDS_SRAM_MPU_BB) U8.E7(VDDS_PLL_DDR) U8.E9(VDDS_SRAM_CORE_BG) U8.H15(VDDS_PLL_MPU) U8.N16(VDDA1P8V_USB0) U8.R10(VDDS_PLL_CORE_LCD) U8.R11(VDDS_OSC) U8.R16(VDDA1P8V_USB1)
LDO_1V8_RTC: C44.1 C45.1 C46.1 C47.1 C48.1 C49.1 C50.1 U8.D7(VDDS_RTC) U8.E6(VDDS) U8.E14(VDDS) U8.F9(VDDS) U8.K13(VDDS) U8.N6(VDDS) U8.P9(VDDS) U8.P14(VDDS)
LDO_3V3: C68.1 C69.1 C70.1 C71.1 C72.1 C73.1 C74.1 C75.1 C76.1 C77.1 C78.1 C79.1 C80.1 U8.E10(VDDSHV6) U8.E11(VDDSHV6) U8.E12(VDDSHV6) U8.E13(VDDSHV6) U8.F14(VDDSHV6) U8.G14(VDDSHV6) U8.H14(VDDSHV4) U8.J14(VDDSHV4) U8.K14(VDDSHV5) U8.L14(VDDSHV5) U8.N5(VDDSHV6) U8.N15(VDDA3P3V_USB0) U8.P5(VDDSHV6) U8.P6(VDDSHV6) U8.P7(VDDSHV1) U8.P8(VDDSHV1) U8.P10(VDDSHV2) U8.P11(VDDSHV2) U8.P12(VDDSHV3) U8.P13(VDDSHV3) U8.R15(VDDA3P3V_USB1)
VDD_1V1_CORE: C51.1 C52.1 C53.1 C54.1 C55.1 C56.1 C57.1 C58.1 C59.1 C60.1 C61.1 U8.F6(VDD_CORE) U8.F7(VDD_CORE) U8.G6(VDD_CORE) U8.G7(VDD_CORE) U8.G10(VDD_CORE) U8.H11(VDD_CORE) U8.J12(VDD_CORE) U8.K6(VDD_CORE) U8.K8(VDD_CORE) U8.K12(VDD_CORE) U8.L6(VDD_CORE) U8.L7(VDD_CORE) U8.L8(VDD_CORE) U8.L9(VDD_CORE) U8.M11(VDD_CORE) U8.M13(VDD_CORE) U8.N8(VDD_CORE) U8.N9(VDD_CORE) U8.N12(VDD_CORE) U8.N13(VDD_CORE)
VDD_1V1_MPU: C40.1 C41.1 C42.1 C43.1 U8.F10(VDD_MPU) U8.F11(VDD_MPU) U8.F12(VDD_MPU) U8.F13(VDD_MPU) U8.G13(VDD_MPU) U8.H13(VDD_MPU) U8.J13(VDD_MPU)
VDD_1V5_DDR3L: C35.1 C36.1 C37.1 C38.1 C39.1 U8.E5(VDDS_DDR) U8.F5(VDDS_DDR) U8.G5(VDDS_DDR) U8.H5(VDDS_DDR) U8.J5(VDDS_DDR) U8.K5(VDDS_DDR) U8.L5(VDDS_DDR)
CAP_VBB_MPU: C85.1 U8.C10(CAP_VBB_MPU)
CAP_VDD_RTC: C84.1 U8.D6(CAP_VDD_RTC)
CAP_VDD_SRAM_CORE: C83.1 U8.D9(CAP_VDD_SRAM_CORE)
CAP_VDD_SRAM_MPU: C82.1 U8.D11(CAP_VDD_SRAM_MPU)
MPU_MON: TP1.1(TP) U8.A2(VDD_MPU_MON)

Not connected (* = marked no-connect by the designer): U8 M5(VPP)*

### Notes on the sheet
- AM3358 Power Rails

### Library data of the parts
C35-C38 C41-C49 C52-C69 C71-C85 = C_0201: Capacitor 0201 SMD
C39 C40 C50 C51 C70 = C_0603: Capacitor 0603 SMD
TP1 = CMP-00028-00002-2: 0.6mm round; Pins: 1
U8 = AM3358BZCZ100: as U8 on sheet SoC_DDR; Manufacturer Part Number: AM3358BZCZ100; Datasheet Link: https://www.ti.com/lit/ds/symlink/am3358.pdf

## Sheet SoC_Control.SchDoc
size A4; SheetNumber: 16; SheetTotal: 22
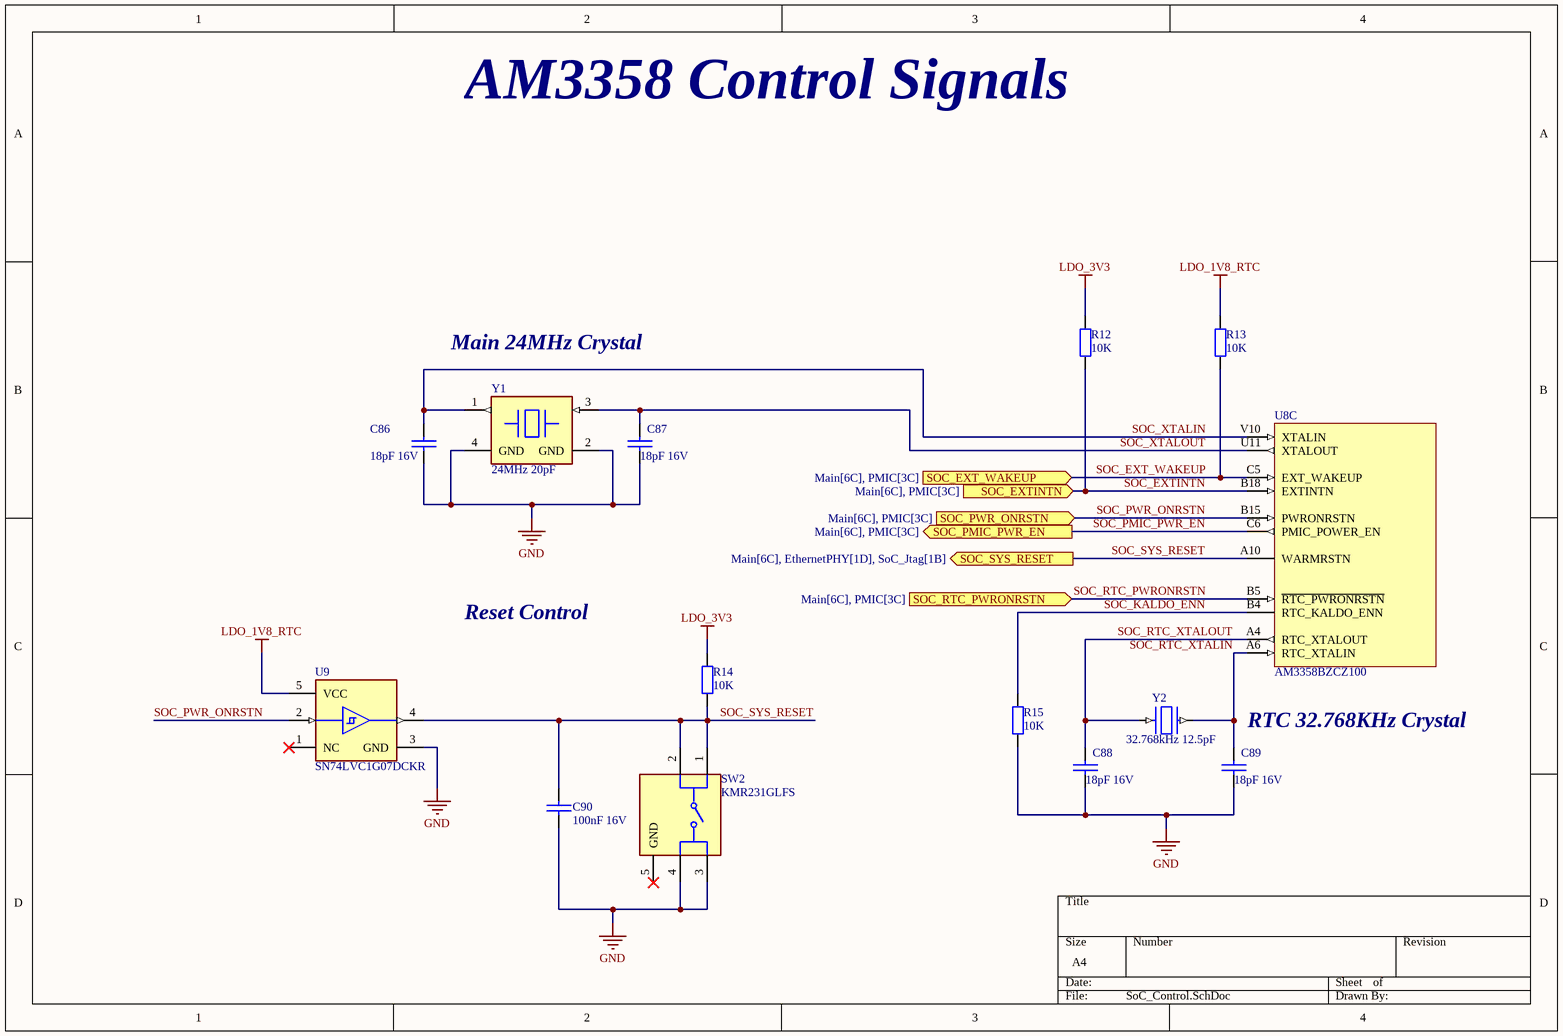
[diagram p9: SoC_Control.SchDoc]

### Parts
C86  18pF 16V  [C_0402]
C87  18pF 16V  [C_0402]
C88  18pF 16V  [C_0402]
C89  18pF 16V  [C_0402]
C90  100nF 16V  [C_0402]
R12  10K  [R_0402]
R13  10K  [R_0402]
R14  10K  [R_0402]
R15  10K  [R_0402]
SW2  KMR231GLFS  [FP-KMR231GLFS-MFG]
U8  AM3358BZCZ100  [BGA324C80P18X18_1500X1500X140]  (part C of 9)
U9  SN74LVC1G07DCKR  [FP-DCK0005A-IPC_C]
Y1  24MHz 20pF  [CRYSTAL_SMD3225-4P]
Y2  32.768kHz 12.5pF  [CRYSTAL_SMD3215-2P]

### Ports
SOC_EXT_WAKEUP (in, see Main[6C], PMIC[3C]), SOC_EXTINTN (in, see Main[6C], PMIC[3C]), SOC_PMIC_PWR_EN (out, see Main[6C], PMIC[3C]), SOC_PWR_ONRSTN (in, see Main[6C], PMIC[3C]), SOC_RTC_PWRONRSTN (in, see Main[6C], PMIC[3C]), SOC_SYS_RESET (out, see Main[6C], EthernetPHY[1D], SoC_Jtag[1B])

### Nets
GND: C86.1 C87.1 C88.1 C89.1 C90.2 R15.1 SW2.3 SW2.4 U9.3(GND) Y1.2(GND) Y1.4(GND)
LDO_1V8_RTC: R13.2 U9.5(VCC)
LDO_3V3: R12.2 R14.2
SOC_EXT_WAKEUP: R13.1 U8.C5(EXT_WAKEUP) ; port SOC_EXT_WAKEUP
SOC_EXTINTN: R12.1 U8.B18(EXTINTN) ; port SOC_EXTINTN
SOC_KALDO_ENN: R15.2 U8.B4(RTC_KALDO_ENN)
SOC_PMIC_PWR_EN: U8.C6(PMIC_POWER_EN) ; port SOC_PMIC_PWR_EN
SOC_PWR_ONRSTN: U8.B15(PWRONRSTN) U9.2(A) ; port SOC_PWR_ONRSTN
SOC_RTC_PWRONRSTN: U8.B5(~{RTC_PWRONRSTN}) ; port SOC_RTC_PWRONRSTN
SOC_RTC_XTALIN: C89.2 U8.A6(RTC_XTALIN) Y2.1
SOC_RTC_XTALOUT: C88.2 U8.A4(RTC_XTALOUT) Y2.2
SOC_SYS_RESET: C90.1 R14.1 SW2.1 SW2.2 U8.A10(WARMRSTN) U9.4(Y) ; port SOC_SYS_RESET
SOC_XTALIN: C86.2 U8.V10(XTALIN) Y1.1(CRYSTAL_1)
SOC_XTALOUT: C87.2 U8.U11(XTALOUT) Y1.3(CRYSTAL_2)

Not connected (* = marked no-connect by the designer): SW2 5(GND)*; U9 1(NC)*

### Notes on the sheet
- AM3358 Control Signals
- Main 24MHz Crystal
- Reset Control
- (near C89) RTC 32.768KHz Crystal

### Library data of the parts
C86-C90 = C_0402: Capacitor 0402 SMD
R12-R15 = R_0402: Resistor 0402 SMD
SW2 = CMP-2000-06516-3: as SW1 on sheet PMIC; Min Operating Temperature: -40°C; Termination: Gull Wing; Orientation: Straight; Lead Free: Lead Free; Width: 2.8mm; Contact Material: Silver; Max Voltage Rating (DC): 32V; Max Current Rating: 50mA; Contact Plating: Silver; Radiation Hardening: No; Depth: 4.6mm; Mount: Surface Mount; Max Operating Temperature: 85°C; Case/Package: SMD/SMT; Contact Current Rating: 50mA; Length: 4.6mm; Package Quantity: 7000; Series: KMR2; REACH SVHC: No SVHC; Packaging: Cut Tape; Voltage Rating (DC): 32V
U8 = AM3358BZCZ100: as U8 on sheet SoC_DDR; Manufacturer Part Number: AM3358BZCZ100; Datasheet Link: https://www.ti.com/lit/ds/symlink/am3358.pdf
U9 = CMP-0859-00290-4: IC BUFF/DVR NON-INVERT SC70-5; Number of Output Lines: 1; Turn-On Delay Time: 8.3ns; Min Supply Voltage: 1.65V; Polarity: Non-Inverting; Quiescent Current: 10uA; Low Level Output Current: 32mA; Nominal Supply Current: 40mA; Logic Function: Buffer; Max Supply Voltage: 5.5V; Number of Bits: 1; Number of Circuits: 1; Contact Plating: Gold; Max Operating Temperature: 125°C; Package Quantity: 1; Number of Channels: 1; Number of Outputs: 1; Case/Package: SC; Number of Gates: 1; Number of Pins: 5; Radiation Hardening: No; Min Operating Temperature: -40°C; Number of Bits per Element: 1; Lead Free: Lead Free; High Level Output Current: 32mA; Number of Input Lines: 1; Number of Inputs: 1; Propagation Delay: 8.3ns; Number of Elements: 1; Packaging: Tape and Reel; Mount: Surface Mount; Termination: SMD/SMT; REACH SVHC: No SVHC
Y1 = X322524MSB4SI: 24MHz Surface Mount Crystal 20pF ±10ppm ±20ppm SMD3225-4P Crystals ROHS; Manufacturer: YXC Crystal Oscillators; Manufacturer Part Number: X322524MSB4SI; Datasheet Link: https://www.lcsc.com/datasheet/lcsc_datasheet_2411121006_YXC-Crystal-Oscillators-X322524MSB4SI_C15643.pdf
Y2 = XKXGI-SUA-32.768K: 32.768kHz Surface Mount Crystal 12.5pF ±20ppm ±30ppm SMD3215-2P Crystals ROHS; Manufacturer: YXC Crystal Oscillators; Manufacturer Part Number: XKXGI-SUA-32.768K; Datasheet Link: https://www.lcsc.com/datasheet/lcsc_datasheet_2210261730_YXC-Crystal-Oscillators-XKXGI-SUA-32-768K_C5213671.pdf

## Sheet eMMCChip.SchDoc
size A3; SheetNumber: 7; SheetTotal: 22
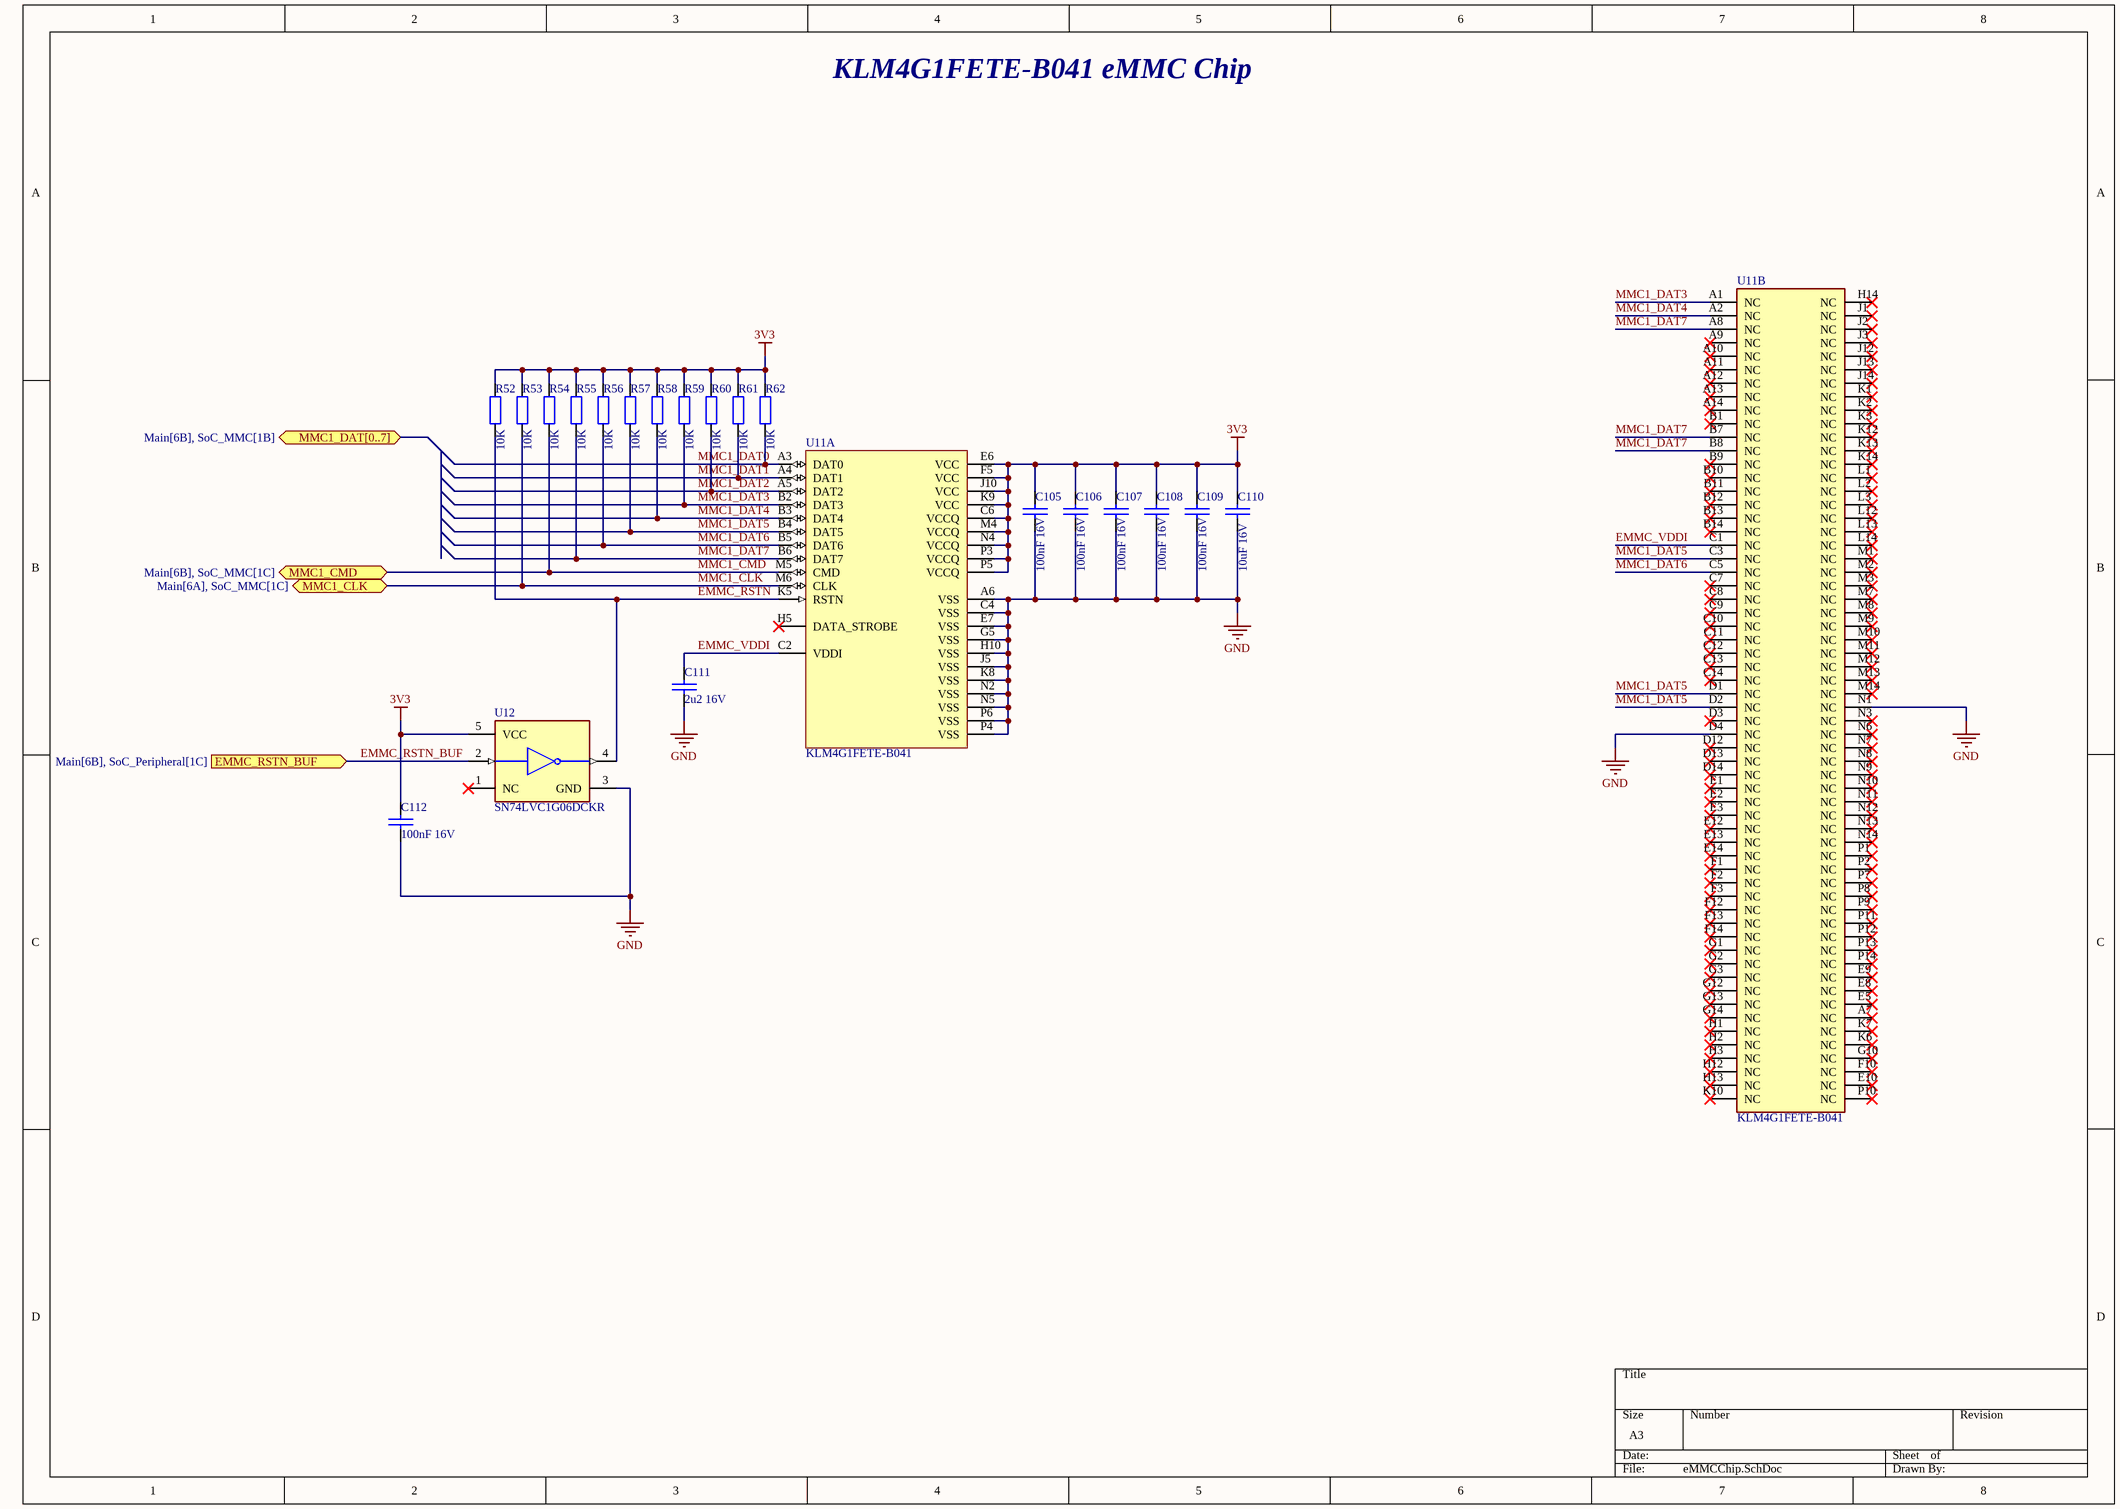
[diagram p10: eMMCChip.SchDoc]

### Parts
C105  100nF 16V  [C_0402]
C106  100nF 16V  [C_0402]
C107  100nF 16V  [C_0402]
C108  100nF 16V  [C_0402]
C109  100nF 16V  [C_0402]
C110  10uF 16V  [C_0603]
C111  2u2 16V  [C_0402]
C112  100nF 16V  [C_0402]
R52  10K  [R_0402]
R53  10K  [R_0402]
R54  10K  [R_0402]
R55  10K  [R_0402]
R56  10K  [R_0402]
R57  10K  [R_0402]
R58  10K  [R_0402]
R59  10K  [R_0402]
R60  10K  [R_0402]
R61  10K  [R_0402]
R62  10K  [R_0402]
U11  KLM4G1FETE-B041  [BGA153C50P14X14_1100X1000X80]  (parts A,B of 2)
U12  SN74LVC1G06DCKR  [FP-DCK0005A-MFG]

### Ports
EMMC_RSTN_BUF (in, see Main[6B], SoC_Peripheral[1C]), MMC1_CLK (bidir, see Main[6A], SoC_MMC[1C]), MMC1_CMD (bidir, see Main[6B], SoC_MMC[1C]), MMC1_DAT[0..7] (bidir, see Main[6B], SoC_MMC[1B])

### Nets
3V3: C105.1 C106.1 C107.1 C108.1 C109.1 C110.1 C112.1 R52.2 R53.2 R54.2 R55.2 R56.2 R57.2 R58.2 R59.2 R60.2 R61.2 R62.2 U11.C6(VCCQ) U11.E6(VCC) U11.F5(VCC) U11.J10(VCC) U11.K9(VCC) U11.M4(VCCQ) U11.N4(VCCQ) U11.P3(VCCQ) U11.P5(VCCQ) U12.5(VCC)
GND: C105.2 C106.2 C107.2 C108.2 C109.2 C110.2 C111.2 C112.2 U11.A6(VSS) U11.C4(VSS) U11.D4(NC) U11.E7(VSS) U11.G5(VSS) U11.H10(VSS) U11.J5(VSS) U11.K8(VSS) U11.N1(NC) U11.N2(VSS) U11.N5(VSS) U11.P4(VSS) U11.P6(VSS) U12.3(GND)
EMMC_RSTN: R52.1 U11.K5(RSTN) U12.4(Y)
EMMC_RSTN_BUF: U12.2(A) ; port EMMC_RSTN_BUF
EMMC_VDDI: C111.1 U11.C1(NC) U11.C2(VDDI)
MMC1_CLK: R53.1 U11.M6(CLK) ; port MMC1_CLK
MMC1_CMD: R54.1 U11.M5(CMD) ; port MMC1_CMD
MMC1_DAT0: R62.1 U11.A3(DAT0)
MMC1_DAT1: R61.1 U11.A4(DAT1)
MMC1_DAT2: R60.1 U11.A5(DAT2)
MMC1_DAT3: R59.1 U11.A1(NC) U11.B2(DAT3)
MMC1_DAT4: R58.1 U11.A2(NC) U11.B3(DAT4)
MMC1_DAT5: R57.1 U11.B4(DAT5) U11.C3(NC) U11.D1(NC) U11.D2(NC)
MMC1_DAT6: R56.1 U11.B5(DAT6) U11.C5(NC)
MMC1_DAT7: R55.1 U11.A8(NC) U11.B6(DAT7) U11.B7(NC) U11.B8(NC)

Not connected (* = marked no-connect by the designer): U11 A7(NC)* A9(NC)* A10(NC)* A11(NC)* A12(NC)* A13(NC)* A14(NC)* B1(NC)* B9(NC)* B10(NC)* B11(NC)* B12(NC)* B13(NC)* B14(NC)* C7(NC)* C8(NC)* C9(NC)* C10(NC)* C11(NC)* C12(NC)* C13(NC)* C14(NC)* D3(NC)* D12(NC)* D13(NC)* D14(NC)* E1(NC)* E2(NC)* E3(NC)* E5(NC)* E8(NC)* E9(NC)* E10(NC)* E12(NC)* E13(NC)* E14(NC)* F1(NC)* F2(NC)* F3(NC)* F10(NC)* F12(NC)* F13(NC)* F14(NC)* G1(NC)* G2(NC)* G3(NC)* G10(NC)* G12(NC)* G13(NC)* G14(NC)* H1(NC)* H2(NC)* H3(NC)* H5(DATA_STROBE)* H12(NC)* H13(NC)* H14(NC)* J1(NC)* J2(NC)* J3(NC)* J12(NC)* J13(NC)* J14(NC)* K1(NC)* K2(NC)* K3(NC)* K6(NC)* K7(NC)* K10(NC)* K12(NC)* K13(NC)* K14(NC)* L1(NC)* L2(NC)* L3(NC)* L12(NC)* L13(NC)* L14(NC)* M1(NC)* M2(NC)* M3(NC)* M7(NC)* M8(NC)* M9(NC)* M10(NC)* M11(NC)* M12(NC)* M13(NC)* M14(NC)* N3(NC)* N6(NC)* N7(NC)* N8(NC)* N9(NC)* N10(NC)* N11(NC)* N12(NC)* N13(NC)* N14(NC)* P1(NC)* P2(NC)* P7(NC)* P8(NC)* P9(NC)* P10(NC)* P11(NC)* P12(NC)* P13(NC)* P14(NC)*; U12 1(NC)*

### Notes on the sheet
- KLM4G1FETE-B041 eMMC Chip

### Library data of the parts
C105-C109 C111 C112 = C_0402: Capacitor 0402 SMD
C110 = C_0603: Capacitor 0603 SMD
R52-R62 = R_0402: Resistor 0402 SMD
U11 = KLM4G1FETE-B041: 4GB 300/19 MB/s eMMC 5.1 FBGA-153(10x11) eMMC ROHS; Manufacturer: Samsung; Manufacturer Part Number: KLM4G1FETE-B041; Datasheet Link: https://www.lcsc.com/datasheet/lcsc_datasheet_2410121848_Samsung-KLM4G1FETE-B041_C500273.pdf
U12 = CMP-0859-00246-4: IC BUFFER INVERT 5.5V SC70-5; Manufacturer: Texas Instruments; Standoff Height: 0mm; Number Of Inputs: 1; Logic Function Desc: Inverting; Min Supply Voltage: 1.65V; Nominal Supply Current: 10uA; Max Junction Temp: +150°C; Propagation Delay: 3.5ns; Manufacturer Part Number: SN74LVC1G06DCKR; Temperature Range High: +125°C; Mouser Description: Buffers & Line Drivers Single Invert w/OD; ComponentLink2URL: http://www.ti.com/lit/ds/symlink/sn74lvc1g06.pdf; Device Class L3: Buffers; Ambient Temperature Range High: +125°C; Temperature: -40°C to +125°C; Automotive: No; RoHS: TRUE; ComponentLink2Description: Datasheet; Ambient Temperature Range Low: -40°C; Lead Free: Yes; Digikey Description: IC BUFFER INVERT 5.5V SC70-5; Number Of Circuits: 1; Package: DCK0005A; Octopart: https://octopart.com/sn74lvc1g06dckr-texas+instruments-465505; Max Supply Voltage: 5.5V; Height: 1.1mm; Number Of Outputs: 1; Device Class L2: Logic ICs; Device Class L1: Integrated Circuits (ICs); Category: IC; Temperature Range Low: -40°C

## Sheet SoC_MMC.SchDoc
size A4; SheetNumber: 19; SheetTotal: 22
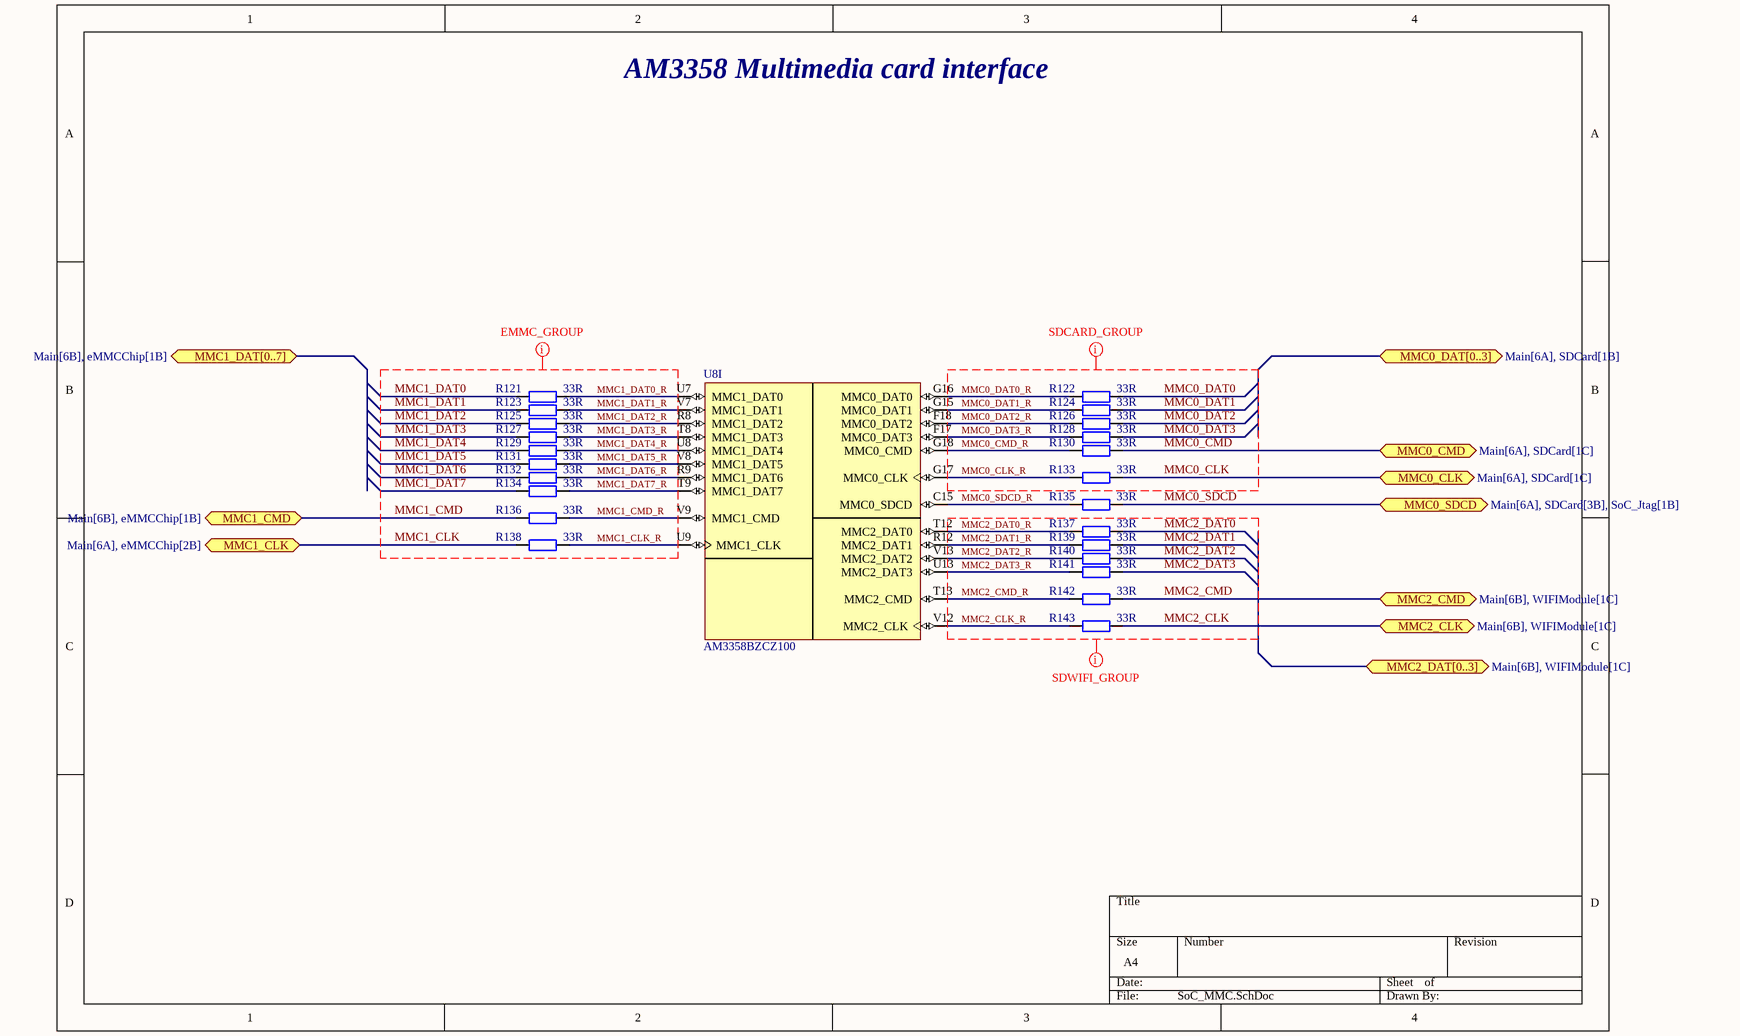
[diagram p11: SoC_MMC.SchDoc]

### Parts
R121  33R  [R_0402]
R122  33R  [R_0402]
R123  33R  [R_0402]
R124  33R  [R_0402]
R125  33R  [R_0402]
R126  33R  [R_0402]
R127  33R  [R_0402]
R128  33R  [R_0402]
R129  33R  [R_0402]
R130  33R  [R_0402]
R131  33R  [R_0402]
R132  33R  [R_0402]
R133  33R  [R_0402]
R134  33R  [R_0402]
R135  33R  [R_0402]
R136  33R  [R_0402]
R137  33R  [R_0402]
R138  33R  [R_0402]
R139  33R  [R_0402]
R140  33R  [R_0402]
R141  33R  [R_0402]
R142  33R  [R_0402]
R143  33R  [R_0402]
U8  AM3358BZCZ100  [BGA324C80P18X18_1500X1500X140]  (part I of 9)

### Ports
MMC0_CLK (bidir, see Main[6A], SDCard[1C]), MMC0_CMD (bidir, see Main[6A], SDCard[1C]), MMC0_DAT[0..3] (bidir, see Main[6A], SDCard[1B]), MMC0_SDCD (bidir, see Main[6A], SDCard[3B], SoC_Jtag[1B]), MMC1_CLK (bidir, see Main[6A], eMMCChip[2B]), MMC1_CMD (bidir, see Main[6B], eMMCChip[1B]), MMC1_DAT[0..7] (bidir, see Main[6B], eMMCChip[1B]), MMC2_CLK (bidir, see Main[6B], WIFIModule[1C]), MMC2_CMD (bidir, see Main[6B], WIFIModule[1C]), MMC2_DAT[0..3] (bidir, see Main[6B], WIFIModule[1C])

### Nets
MMC0_CLK: R133.2 ; port MMC0_CLK
MMC0_CLK_R: R133.1 U8.G17(MMC0_CLK)
MMC0_CMD: R130.2 ; port MMC0_CMD
MMC0_CMD_R: R130.1 U8.G18(MMC0_CMD)
MMC0_DAT0: R122.2
MMC0_DAT0_R: R122.1 U8.G16(MMC0_DAT0)
MMC0_DAT1: R124.2
MMC0_DAT1_R: R124.1 U8.G15(MMC0_DAT1)
MMC0_DAT2: R126.2
MMC0_DAT2_R: R126.1 U8.F18(MMC0_DAT2)
MMC0_DAT3: R128.2
MMC0_DAT3_R: R128.1 U8.F17(MMC0_DAT3)
MMC0_SDCD: R135.2 ; port MMC0_SDCD
MMC0_SDCD_R: R135.1 U8.C15(MMC0_SDCD)
MMC1_CLK: R138.1 ; port MMC1_CLK
MMC1_CLK_R: R138.2 U8.U9(MMC1_CLK)
MMC1_CMD: R136.1 ; port MMC1_CMD
MMC1_CMD_R: R136.2 U8.V9(MMC1_CMD)
MMC1_DAT0: R121.1
MMC1_DAT0_R: R121.2 U8.U7(MMC1_DAT0)
MMC1_DAT1: R123.1
MMC1_DAT1_R: R123.2 U8.V7(MMC1_DAT1)
MMC1_DAT2: R125.1
MMC1_DAT2_R: R125.2 U8.R8(MMC1_DAT2)
MMC1_DAT3: R127.1
MMC1_DAT3_R: R127.2 U8.T8(MMC1_DAT3)
MMC1_DAT4: R129.1
MMC1_DAT4_R: R129.2 U8.U8(MMC1_DAT4)
MMC1_DAT5: R131.1
MMC1_DAT5_R: R131.2 U8.V8(MMC1_DAT5)
MMC1_DAT6: R132.1
MMC1_DAT6_R: R132.2 U8.R9(MMC1_DAT6)
MMC1_DAT7: R134.1
MMC1_DAT7_R: R134.2 U8.T9(MMC1_DAT7)
MMC2_CLK: R143.2 ; port MMC2_CLK
MMC2_CLK_R: R143.1 U8.V12(MMC2_CLK)
MMC2_CMD: R142.2 ; port MMC2_CMD
MMC2_CMD_R: R142.1 U8.T13(MMC2_CMD)
MMC2_DAT0: R137.2
MMC2_DAT0_R: R137.1 U8.T12(MMC2_DAT0)
MMC2_DAT1: R139.2
MMC2_DAT1_R: R139.1 U8.R12(MMC2_DAT1)
MMC2_DAT2: R140.2
MMC2_DAT2_R: R140.1 U8.V13(MMC2_DAT2)
MMC2_DAT3: R141.2
MMC2_DAT3_R: R141.1 U8.U13(MMC2_DAT3)

### Layout directives
net class EMMC_GROUP: MMC1_CLK, MMC1_CLK_R, MMC1_CMD, MMC1_CMD_R, MMC1_DAT0, MMC1_DAT0_R, MMC1_DAT1, MMC1_DAT1_R, MMC1_DAT2, MMC1_DAT2_R, MMC1_DAT3, MMC1_DAT3_R, MMC1_DAT4, MMC1_DAT4_R, MMC1_DAT5, MMC1_DAT5_R, MMC1_DAT6, MMC1_DAT6_R, MMC1_DAT7, MMC1_DAT7_R
net class SDCARD_GROUP: MMC0_CLK, MMC0_CLK_R, MMC0_CMD, MMC0_CMD_R, MMC0_DAT0, MMC0_DAT0_R, MMC0_DAT1, MMC0_DAT1_R, MMC0_DAT2, MMC0_DAT2_R, MMC0_DAT3, MMC0_DAT3_R
net class SDWIFI_GROUP: MMC2_CLK, MMC2_CLK_R, MMC2_CMD, MMC2_CMD_R, MMC2_DAT0, MMC2_DAT0_R, MMC2_DAT1, MMC2_DAT1_R, MMC2_DAT2, MMC2_DAT2_R, MMC2_DAT3, MMC2_DAT3_R

### Notes on the sheet
- AM3358 Multimedia card interface

### Library data of the parts
R121-R143 = R_0402: Resistor 0402 SMD
U8 = AM3358BZCZ100: as U8 on sheet SoC_DDR; Manufacturer Part Number: AM3358BZCZ100; Datasheet Link: https://www.ti.com/lit/ds/symlink/am3358.pdf